# EAGLE design MicroMod-Teensy (EAGLE 9.6.2)
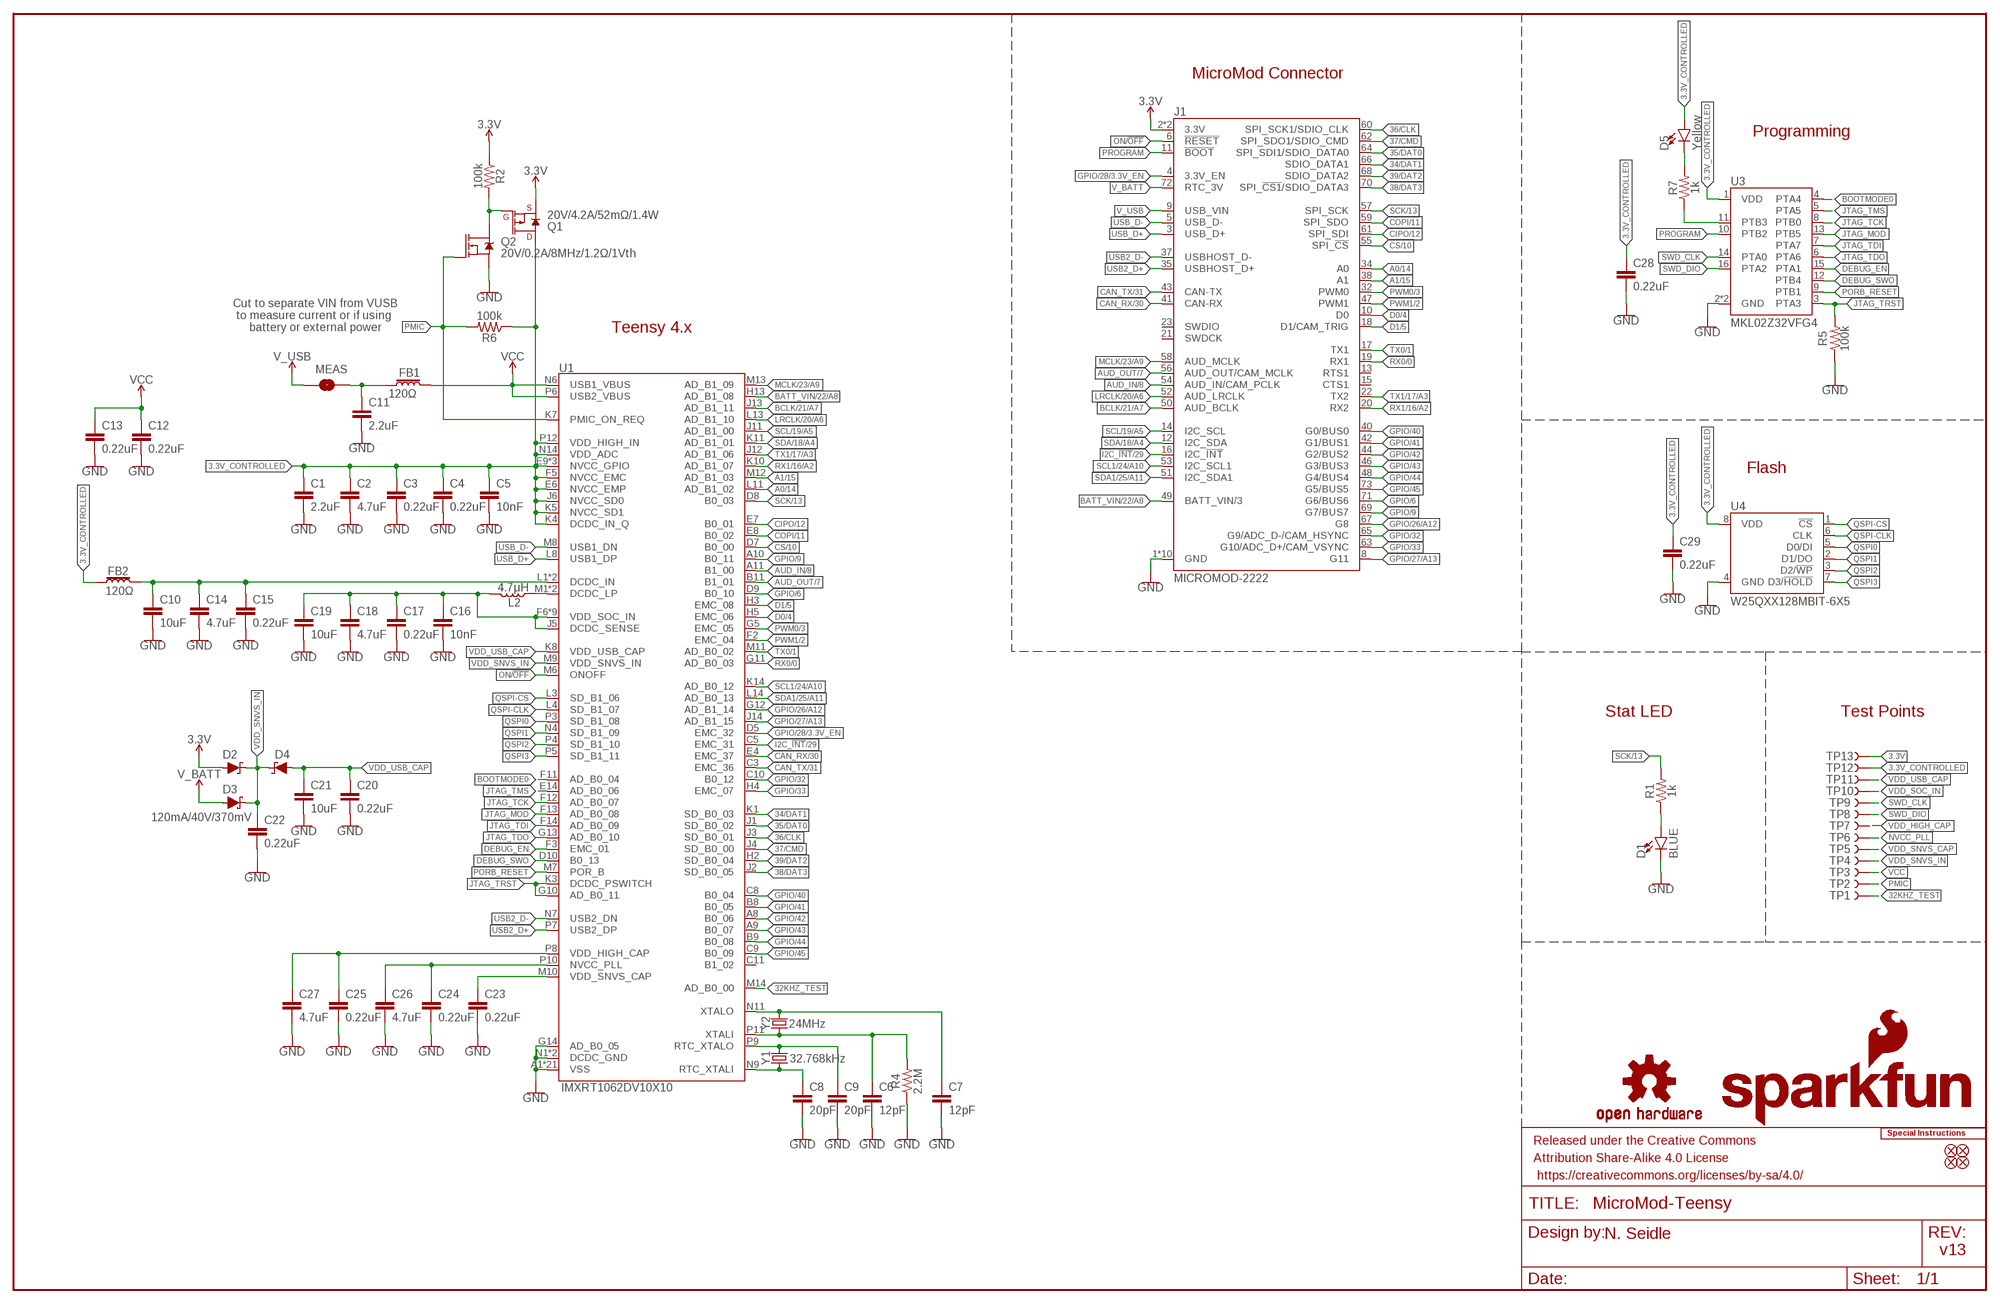
[diagram p0: schematic, sheet 1]

## Parts
C1  2.2uF  2.2UF-0402_TIGHT-10V-10%-X5R  [0402-TIGHT]
C2  4.7uF  4.7UF-0402_TIGHT-6.3V-20%-X5R  [0402-TIGHT]
C3  0.22uF  0.22UF-0402T-10V-10%  [0402-TIGHT]
C4  0.22uF  0.22UF-0402T-10V-10%  [0402-TIGHT]
C5  10nF  10NF-0402T-25V-10%  [0402-TIGHT]
C6  12pF  12PF-0402T-50V-5%  [0402-TIGHT]
C7  12pF  12PF-0402T-50V-5%  [0402-TIGHT]
C8  20pF  20PF-0402T-50V-5%  [0402-TIGHT]
C9  20pF  20PF-0402T-50V-5%  [0402-TIGHT]
C10  10uF  10UF-0402T-6.3V-20%  [0402-TIGHT]
C11  2.2uF  2.2UF-0402_TIGHT-10V-10%-X5R  [0402-TIGHT]
C12  0.22uF  0.22UF-0402T-10V-10%  [0402-TIGHT]
C13  0.22uF  0.22UF-0402T-10V-10%  [0402-TIGHT]
C14  4.7uF  4.7UF-0402_TIGHT-6.3V-20%-X5R  [0402-TIGHT]
C15  0.22uF  0.22UF-0402T-10V-10%  [0402-TIGHT]
C16  10nF  10NF-0402T-25V-10%  [0402-TIGHT]
C17  0.22uF  0.22UF-0402T-10V-10%  [0402-TIGHT]
C18  4.7uF  4.7UF-0402_TIGHT-6.3V-20%-X5R  [0402-TIGHT]
C19  10uF  10UF-0402T-6.3V-20%  [0402-TIGHT]
C20  0.22uF  0.22UF-0402T-10V-10%  [0402-TIGHT]
C21  10uF  10UF-0402T-6.3V-20%  [0402-TIGHT]
C22  0.22uF  0.22UF-0402T-10V-10%  [0402-TIGHT]
C23  0.22uF  0.22UF-0402T-10V-10%  [0402-TIGHT]
C24  0.22uF  0.22UF-0402T-10V-10%  [0402-TIGHT]
C25  0.22uF  0.22UF-0402T-10V-10%  [0402-TIGHT]
C26  4.7uF  4.7UF-0402_TIGHT-6.3V-20%-X5R  [0402-TIGHT]
C27  4.7uF  4.7UF-0402_TIGHT-6.3V-20%-X5R  [0402-TIGHT]
C28  0.22uF  0.22UF-0402T-10V-10%  [0402-TIGHT]
C29  0.22uF  0.22UF-0402T-10V-10%  [0402-TIGHT]
D1  BLUE  LED-BLUE0603  [LED-0603]
D2  120mA/40V/370mV  DIODE-SCHOTTKY-RB751S40  [SOD-523]
D3  120mA/40V/370mV  DIODE-SCHOTTKY-RB751S40  [SOD-523]
D4  120mA/40V/370mV  DIODE-SCHOTTKY-RB751S40  [SOD-523]
D5  Yellow  LED-YELLOW0603  [LED-0603]
FB1  120Ω  FERRITE_BEAD-120_OHM-0402T  [0402-TIGHT]
FB2  120Ω  FERRITE_BEAD-120_OHM-0402T  [0402-TIGHT]
FD1  FIDUCIALUFIDUCIAL  [FIDUCIAL-MICRO]
FD2  FIDUCIALUFIDUCIAL  [FIDUCIAL-MICRO]
FD3  FIDUCIALUFIDUCIAL  [FIDUCIAL-MICRO]
FD4  FIDUCIALUFIDUCIAL  [FIDUCIAL-MICRO]
FRAME1  FRAME-LEDGER  [CREATIVE_COMMONS]
J1  MICROMOD-2222  [M.2-CARD-E-22]
L2  4.7μH  4.7μH_SHIELDED_INDUCTOR  [1008(2520)]
LOGO1  SFE_LOGO_NAME_FLAME.1_INCH  [SFE_LOGO_NAME_FLAME_.1]
LOGO2  OSHW-LOGONO_SILK  [DUMMY]
LOGO3  SPECIAL_INSTRUCTIONS-ORDERING  [ORDERING_INSTRUCTIONS]
MEAS  JUMPER-SMT_2_NC_TRACE_SILK  [SMT-JUMPER_2_NC_TRACE_SILK]
Q1  20V/4.2A/52mΩ/1.4W  MOSFET_PCH-DMG2305UX-7  [SOT23-3]
Q2  20V/0.2A/8MHz/1.2Ω/1Vth  MOSFET-NCH-RE1C00UNTL  [SOT-416FL]
R1  1k  1KOHM-0402T-1/16W-1%  [0402-TIGHT]
R2  100k  100KOHM-0402T-1/16W-1%  [0402-TIGHT]
R4  2.2M  2.2MOHMS-0402T-1/10W-1%  [0402-TIGHT]
R5  100k  100KOHM-0402T-1/16W-1%  [0402-TIGHT]
R6  100k  100KOHM-0402T-1/16W-1%  [0402-TIGHT]
R7  1k  1KOHM-0402T-1/16W-1%  [0402-TIGHT]
TP1  TEST-POINT3  [PAD.03X.03]
TP2  TEST-POINT3  [PAD.03X.03]
TP3  TEST-POINT3  [PAD.03X.03]
TP4  TEST-POINT3  [PAD.03X.03]
TP5  TEST-POINT3  [PAD.03X.03]
TP6  TEST-POINT3  [PAD.03X.03]
TP7  TEST-POINT3  [PAD.03X.03]
TP8  TEST-POINT3  [PAD.03X.03]
TP9  TEST-POINT3  [PAD.03X.03]
TP10  TEST-POINT3  [PAD.03X.03]
TP11  TEST-POINT3  [PAD.03X.03]
TP12  TEST-POINT3  [PAD.03X.03]
TP13  TEST-POINT3  [PAD.03X.03]
U1  IMXRT1062DV10X10  [IMXRT1062]
U3  MKL02Z32VFG4  MKL02Z32VFG4QFN-16  [QFN-16]
U4  W25QXX128MBIT-6X5  W25QXX128MBIT-6X5-SKINNY_CENTER  [WSON-8-6X5-SKINNY_CENTERPAD]
Y1  32.768kHz  CRYSTAL-32.768KHZSMD-3.2X1.5  [CRYSTAL-SMD-3.2X1.5MM]
Y2  24MHz  CRYSTAL-24MHZ-SMD-2.0X1.6MM  [CRYSTAL-SMD-2.0X1.6MM]

## Nets
3.3V: D2.A J1.2(3.3V) J1.74(3.3V) Q1.2(S) R2.1 TP13.P$1
3.3V_CONTROLLED [InternalPower]: C1.1 C2.1 C3.1 C4.1 C5.1 C28.1 C29.1 D5.A FB2.1 Q1.3(D) R6.1 TP12.P$1 U1.E6(NVCC_EMP) U1.E9(NVCC_GPIO) U1.F5(NVCC_EMC) U1.F10(NVCC_GPIO) U1.J6(NVCC_SD0) U1.J10(NVCC_GPIO) U1.K4(DCDC_IN_Q) U1.K5(NVCC_SD1) U1.N14(VDD_ADC) U1.P12(VDD_HIGH_IN) U3.1(VDD) U4.8(VDD)
24MHZ_1: C7.1 U1.N11(XTALO) Y2.3
24MHZ_2: C6.1 R4.2 U1.P11(XTALI) Y2.1
32KHZ_1: C8.1 U1.N9(RTC_XTALI) Y1.P$1
32KHZ_2: C9.1 U1.P9(RTC_XTALO) Y1.P$2
32KHZ_TEST: TP1.P$1 U1.M14(AD_B0_00)
34/DAT1: J1.66(SDIO_DATA1) U1.K1(SD_B0_03)
35/DAT0: J1.64(SPI_SDI1/SDIO_DATA0) U1.J1(SD_B0_02)
36/CLK [Clock]: J1.60(SPI_SCK1/SDIO_CLK) U1.J3(SD_B0_01)
37/CMD: J1.62(SPI_SDO1/SDIO_CMD) U1.J4(SD_B0_00)
38/DAT3: J1.70(SPI_!CS1!/SDIO_DATA3) U1.J2(SD_B0_05)
39/DAT2: J1.68(SDIO_DATA2) U1.H2(SD_B0_04)
A0/14: J1.34(A0) U1.L11(AD_B1_02)
A1/15: J1.38(A1) U1.M12(AD_B1_03)
AUD_IN/8: J1.54(AUD_IN/CAM_PCLK) U1.A11(B1_00)
AUD_OUT/7: J1.56(AUD_OUT/CAM_MCLK) U1.B11(B1_01)
BATT_VIN/22/A8: J1.49(BATT_VIN/3) U1.H13(AD_B1_08)
BCLK/21/A7: J1.50(AUD_BCLK) U1.J13(AD_B1_11)
BOOTMODE0: U1.F11(AD_B0_04) U3.4(PTA4)
CAN_RX/30: J1.41(CAN-RX) U1.E4(EMC_37)
CAN_TX/31: J1.43(CAN-TX) U1.C3(EMC_36)
CIPO/12: J1.61(SPI_SDI) U1.E7(B0_01)
COPI/11: J1.59(SPI_SDO) U1.E8(B0_02)
CS/10: J1.55(SPI_!CS!) U1.D7(B0_00)
D0/4: J1.10(D0) U1.H5(EMC_06)
D1/5: J1.18(D1/CAM_TRIG) U1.H3(EMC_08)
DCDC_IN [InternalPower]: C10.1 C14.1 C15.1 FB2.2 U1.L1(DCDC_IN) U1.L2(DCDC_IN)
DCDC_LP [DCBoost]: L2.1 U1.M1(DCDC_LP) U1.M2(DCDC_LP)
DEBUG_EN: U1.F3(EMC_01) U3.15(PTA1)
DEBUG_SWO: U1.D10(B0_13) U3.12(PTB4)
GND: C1.2 C2.2 C3.2 C4.2 C5.2 C6.2 C7.2 C8.2 C9.2 C10.2 C11.2 C12.2 C13.2 C14.2 C15.2 C16.2 C17.2 C18.2 C19.2 C20.2 C21.2 C22.2 C23.2 C24.2 C25.2 C26.2 C27.2 C28.2 C29.2 D1.C J1.1(GND) J1.7(GND) J1.33(GND) J1.36(GND) J1.39(GND) J1.45(GND) J1.75(GND) J1.GND1(GND) J1.GND2(GND) J1.GND3(GND) Q2.2(S) R4.1 R5.1 U1.A1(VSS) U1.A14(VSS) U1.B5(VSS) U1.B10(VSS) U1.E2(VSS) U1.E13(VSS) U1.G7(VSS) U1.G8(VSS) U1.G14(AD_B0_05) U1.H7(VSS) U1.H8(VSS) U1.J7(VSS) U1.J8(VSS) U1.K2(VSS) U1.K6(VSS) U1.K9(VSS) U1.K13(VSS) U1.L9(VSS) U1.N1(DCDC_GND) U1.N2(DCDC_GND) U1.N5(VSS) U1.N8(VSS) U1.P1(VSS) U1.P14(VSS) U3.2(GND) U3.17(GND) U4.4(GND)
GPIO/6: J1.71(G6/BUS6) U1.D9(B0_10)
GPIO/9: J1.69(G7/BUS7) U1.A10(B0_11)
GPIO/26/A12: J1.67(G8) U1.G12(AD_B1_14)
GPIO/27/A13: J1.8(G11) U1.J14(AD_B1_15)
GPIO/28/3.3V_EN: J1.4(3.3V_EN) U1.D5(EMC_32)
GPIO/32: J1.65(G9/ADC_D-/CAM_HSYNC) U1.C10(B0_12)
GPIO/33: J1.63(G10/ADC_D+/CAM_VSYNC) U1.H4(EMC_07)
GPIO/40: J1.40(G0/BUS0) U1.C8(B0_04)
GPIO/41: J1.42(G1/BUS1) U1.B8(B0_05)
GPIO/42: J1.44(G2/BUS2) U1.A8(B0_06)
GPIO/43: J1.46(G3/BUS3) U1.A9(B0_07)
GPIO/44: J1.48(G4/BUS4) U1.B9(B0_08)
GPIO/45: J1.73(G5/BUS5) U1.C9(B0_09)
I2C_!INT!/29: J1.16(I2C_!INT!) U1.C5(EMC_31)
JTAG_MOD: U1.F13(AD_B0_08) U3.13(PTB5)
JTAG_TCK: U1.F12(AD_B0_07) U3.8(PTB0)
JTAG_TDI: U1.F14(AD_B0_09) U3.7(PTA7)
JTAG_TDO: U1.G13(AD_B0_10) U3.6(PTA6)
JTAG_TMS: U1.E14(AD_B0_06) U3.5(PTA5)
JTAG_TRST: R5.2 U1.G10(AD_B0_11) U1.K3(DCDC_PSWITCH) U3.3(PTA3)
LRCLK/20/A6: J1.52(AUD_LRCLK) U1.L13(AD_B1_10)
MCLK/23/A9: J1.58(AUD_MCLK) U1.M13(AD_B1_09)
N$2: D1.A R1.1
N$7: Q1.1(G) Q2.3(D) R2.2
N$10 [InternalPower]: C11.1 FB1.1 MEAS.2
N$12: R7.1 U3.11(PTB3)
N$13: D5.C R7.2
NVCC_PLL: C24.1 C26.1 TP6.P$1 U1.P10(NVCC_PLL)
ON/!OFF!: J1.6(!RESET!) U1.M6(ONOFF)
PMIC: Q2.1(G) R6.2 TP2.P$1 U1.K7(PMIC_ON_REQ)
PORB_RESET: U1.M7(POR_B) U3.9(PTB1)
PROGRAM: J1.11(!BOOT!) U3.10(PTB2)
PWM0/3: J1.32(PWM0) U1.G5(EMC_05)
PWM1/2: J1.47(PWM1) U1.F2(EMC_04)
QSPI0: U1.P3(SD_B1_08) U4.5(D0/DI)
QSPI1: U1.N4(SD_B1_09) U4.2(D1/DO)
QSPI2: U1.P4(SD_B1_10) U4.3(D2/!WP!)
QSPI3: U1.P5(SD_B1_11) U4.7(D3/!HOLD!)
QSPI-CLK [Clock]: U1.L4(SD_B1_07) U4.6(CLK)
QSPI-CS: U1.L3(SD_B1_06) U4.1(!CS!)
RX0/0: J1.19(RX1) U1.G11(AD_B0_03)
RX1/16/A2: J1.20(RX2) U1.K10(AD_B1_07)
SCK/13 [Clock]: J1.57(SPI_SCK) R1.2 U1.D8(B0_03)
SCL1/24/A10: J1.53(I2C_SCL1) U1.K14(AD_B0_12)
SCL/19/A5: J1.14(I2C_SCL) U1.J11(AD_B1_00)
SDA1/25/A11: J1.51(I2C_SDA1) U1.L14(AD_B0_13)
SDA/18/A4: J1.12(I2C_SDA) U1.K11(AD_B1_01)
SWD_CLK: TP9.P$1 U3.14(PTA0)
SWD_DIO: TP8.P$1 U3.16(PTA2)
TX0/1: J1.17(TX1) U1.M11(AD_B0_02)
TX1/17/A3: J1.22(TX2) U1.J12(AD_B1_06)
USB2_D+ [90Ohm]: J1.35(USBHOST_D+) U1.P7(USB2_DP)
USB2_D- [90Ohm]: J1.37(USBHOST_D-) U1.N7(USB2_DN)
USB_D+ [90Ohm]: J1.3(USB_D+) U1.L8(USB1_DP)
USB_D- [90Ohm]: J1.5(USB_D-) U1.M8(USB1_DN)
V_BATT: D3.A J1.72(RTC_3V)
V_USB [InternalPower]: J1.9(USB_VIN) MEAS.1
VCC [InternalPower]: C12.1 C13.1 FB1.2 TP3.P$1 U1.N6(USB1_VBUS) U1.P6(USB2_VBUS)
VDD_HIGH_CAP: C25.1 C27.1 TP7.P$1 U1.P8(VDD_HIGH_CAP)
VDD_SNVS_CAP: C23.1 TP5.P$1 U1.M10(VDD_SNVS_CAP)
VDD_SNVS_IN: C22.1 D2.C D3.C D4.C TP4.P$1 U1.M9(VDD_SNVS_IN)
VDD_SOC_IN [InternalPower]: C16.1 C17.1 C18.1 C19.1 L2.2 TP10.P$1 U1.F6(VDD_SOC_IN) U1.F7(VDD_SOC_IN) U1.F8(VDD_SOC_IN) U1.F9(VDD_SOC_IN) U1.G6(VDD_SOC_IN) U1.G9(VDD_SOC_IN) U1.H6(VDD_SOC_IN) U1.H9(VDD_SOC_IN) U1.J5(DCDC_SENSE) U1.J9(VDD_SOC_IN)
VDD_USB_CAP: C20.1 C21.1 D4.A TP11.P$1 U1.K8(VDD_USB_CAP)
Unconnected: J1.13(RTS1) J1.15(CTS1) J1.21(SWDCK) J1.23(SWDIO) U1.C11(B1_02)

## Notes on the sheet
- MicroMod Connector
- Programming
- Cut to separate VIN from VUSB
  to measure current or if using 
  battery or external power
- Teensy 4.x
- Flash
- Stat LED | Test Points
- N. Seidle
- v13

## Library data of the parts
C1 C11 = SparkFun-Capacitors:2.2UF: 2.2µF ceramic capacitors A capacitor is a passive two-terminal electrical component used to store electrical energy temporarily in an electric field.; PROD_ID: CAP-14232
C2 C14 C18 C26 C27 = SparkFun-Capacitors:4.7UF: 4.7µF ceramic capacitors A capacitor is a passive two-terminal electrical component used to store electrical energy temporarily in an electric field.; PROD_ID: CAP-14240
C3 C4 C12 C13 C15 C17 C20 C22-C25 C28 C29 = SparkFun-Capacitors:0.22UF: 0.22µF ceramic capacitors A capacitor is a passive two-terminal electrical component used to store electrical energy temporarily in an electric field.; PROD_ID: CAP-14846
C5 C16 = SparkFun-Capacitors:10NF: 0.01uF/10nF/10,000pF ceramic capacitors A capacitor is a passive two-terminal electrical component used to store electrical energy temporarily in an electric field. CAP-09321; PROD_ID: CAP-14847
C6 C7 = SparkFun-Capacitors:12PF: 12pF ceramic capacitors A capacitor is a passive two-terminal electrical component used to store electrical energy temporarily in an electric field.; PROD_ID: CAP-14665
C8 C9 = SparkFun-Capacitors:20PF: 20pF ceramic capacitors A capacitor is a passive two-terminal electrical component used to store electrical energy temporarily in an electric field.; PROD_ID: CAP-14843
C10 C19 C21 = SparkFun-Capacitors:10UF: 10.0µF ceramic capacitors A capacitor is a passive two-terminal electrical component used to store electrical energy temporarily in an electric field.; PROD_ID: CAP-14848
D1 = SparkFun-LED:LED-BLUE: Blue SMD LED Used in manufacturing of various products at SparkFun Packages: 0603 - SMD 0603 package [Product Link] <http://www.digikey.com/product-detail/en/SMLE12BC7TT86/511-1589-2-ND/1641808> 1206 - SMD1206 package [Product Link] <http://www.digikey.com/product-detail/en/lite-on-inc/LTST-C150TBKT/160-1643-1-ND/573584> SparkFun Products: ESP8266 Thing-Dev Board <https://www.sparkfun.com/products/13711> RedBoard <https://www.sparkfun.com/products/12757>; PROD_ID: DIO-08575
D2-D4 = SparkFun-DiscreteSemi:DIODE-SCHOTTKY: Schottky diode A Schottky diode is a semiconductor diode which has a low forward voltage drop and a very fast switching action.; PROD_ID: DIO-11018
D5 = SparkFun-LED:LED-YELLOW: Yellow SMD LED Used in manufacturing several products at SparkFun. Packages: 0603 - SMD 0603 package[Product Link] <http://www.kingbrightusa.com/product.asp?catalog_name=LED&product_id=APT1608SYCK> 0603 -SMART - SMART SMD 0603 package (more efficient/more expensive) [Product Link] <http://www.osram-os.com/osram_os/en/products/product-catalog/led-light-emitting-diodes/smartled-0603/ly-l29k/index.jsp> LilyPad - SMD1206 package[Product Datasheet] <https://www.sparkfun.com/datasheets/DevTools/LilyPad/Q150YUS4.pdf> SparkFun Products: Blynk Board <https://www.sparkfun.com/products/13794> IOIO-OTG <https://www.sparkfun.com/products/13613> XBee Explorer Serial <https://www.sparkfun.com/products/13225>; PROD_ID: DIO-09003
FB1 FB2 = SparkFun-Coils:FERRITE_BEAD-120_OHM: Ferrite Bead (blocks, cores, rings, chokes, etc.) Inductor with layers of ferrite used to suppress high frequencies. Often used to isolate high frequency noise.; PROD_ID: NDUC-14206
FD1-FD4 = SparkFun-Aesthetics:FIDUCIAL: Fiducial Alignment Points Point-of-reference for pick-and-place machines and other optical instruments.
FRAME1 = SparkFun-Aesthetics:FRAME-LEDGER: Schematic Frame - Ledger Standard 11x14 US Ledger frame
J1 = SparkFun-MicroMod:MICROMOD: MicroMod Connector Description: A card edge connector and mating PCB connector to allow various MicroMod Processor Boards to be coupled with various carrier boards of different capabilities. Based on the M.2 standard.
L2 = SparkFun-Coils:4.7μH_SHIELDED_INDUCTOR: 4.7uH Inductor 4.7uH 1.4A 50mOhm 1008(2520) Package Shielded; PROD_ID: NDUC-14880
LOGO1 = SparkFun-Aesthetics:SFE_LOGO_NAME_FLAME: SparkFun Font Logo w/ Flame This is the SparkFun full logo. The logo on the schematic will always be the same size; the package variant is the height of the flame part of the logo. Default layer for the logo on the board is tSilk.
LOGO2 = SparkFun-Aesthetics:OSHW-LOGO: Open-Source Hardware (OSHW) Logo This logo indicates the piece of hardware it is found on incorporates a OSHW license and/or adheres to the definition of open source hardware found here: http://freedomdefined.org/OSHW
LOGO3 = SparkFun-Aesthetics:SPECIAL_INSTRUCTIONS: Special Ordering/Production Instructions Alert Symbol for special PCB ordering instructions or unique production process warnings. Ordering Instructions Production Instructions Types of information that should be added to box: Copper weight Soldermask color Silk color PCB thickness Number of layers PCB Standard: 1.6mm FR4 1 oz copper immersion silver plating red soldermask white silkscreen Types of information that should be added to box: Special wash requirements Depaneling instructions Humidification Glue curing Default text settings: 0.07 inch 9% ratio 50% line distance
MEAS = SparkFun-Jumpers:JUMPER-SMT_2_NC_TRACE: Normally closed trace jumper This jumper has a trace between two pads so it's normally closed (NC). Use a razor knife to open the connection. For best results follow the IPC guidelines for cutting traces: Cutout at least 0.063 mm (0.005 in). Remove all loose material to clean up the cut area. Seal the cut with an approved epoxy. Reapply solder to reclose the connection.
Q1 = SparkFun-DiscreteSemi:MOSFET_PCH: P-channel MOSFETs Voltage controlled devices that allow control of high current outputs. SparkFun Products: SparkFun ESP32 Thing <https://www.sparkfun.com/products/13907> SparkFun ESP8266 Thing <https://www.sparkfun.com/products/13231> SparkFun Pi Servo HAT V2 <https://www.sparkfun.com/products/15316> DMG2305UX-7 (20V/4.2A/SOT23-3); PROD_ID: TRAN-14388
Q2 = SparkFun-DiscreteSemi:MOSFET-NCH: N-channel MOSFETs Voltage controlled devices that allow control of high current outputs. SparkFun Products: SparkFun OpenScale <https://www.sparkfun.com/products/13261> SparkFun Digital Sandbox <https://www.sparkfun.com/products/12651> SparkFun Monster Moto Shield <https://www.sparkfun.com/products/10182> SparkFun MOSFET Power Controller <https://www.sparkfun.com/products/11214>; PROD_ID: TRANS-14399
R1 R7 = SparkFun-Resistors:1KOHM: 1kΩ resistor A resistor is a passive two-terminal electrical component that implements electrical resistance as a circuit element. Resistors act to reduce current flow, and, at the same time, act to lower voltage levels within circuits. - Wikipedia; PROD_ID: RES-14342
R2 R5 R6 = SparkFun-Resistors:100KOHM: 100kΩ resistor A resistor is a passive two-terminal electrical component that implements electrical resistance as a circuit element. Resistors act to reduce current flow, and, at the same time, act to lower voltage levels within circuits. - Wikipedia; PROD_ID: RES-13495
R4 = SparkFun-Resistors:2.2MOHMS: 2MΩ resistor A resistor is a passive two-terminal electrical component that implements electrical resistance as a circuit element. Resistors act to reduce current flow, and, at the same time, act to lower voltage levels within circuits. - Wikipedia; PROD_ID: RES-14844
TP1-TP13 = SparkFun-Connectors:TEST-POINT: SparkFun Test Points Bare copper test points for troubleshooting or In-Circuit-Testing. These are used by our Production team for verifying production board runs using pogo-pins on test beds. SparkFun Products: SparkFun LSM9DS1 Breakout <https://www.sparkfun.com/products/13284> SparkFun PSOC <https://www.sparkfun.com/products/13714> SparkFun Load Cell Amplifier <https://www.sparkfun.com/products/13879>
U1 = Teensy:IMXRT1062DV; PROD_ID: IC-14904
U3 = Teensy:MKL02Z32VFG4; PROD_ID: IC-14906
U4 = SparkFun-MicroMod:W25QXX; PROD_ID: IC-15107
Y1 = SparkFun-Clocks:CRYSTAL-32.768KHZ: 32.768kHz Crystal Frequency: 32.768kHz Frequency Stability: ±20ppm Load Capacitance: 12.5pF (PTH-2X6 & SMD-3.2X1.5), 6pF (SMD-2X6) SparkFun Products: SparkFun BigTime Watch Kit <https://www.sparkfun.com/products/11734> SparkFun nRF52832 Breakout <https://www.sparkfun.com/products/13990> SparkFun Real Time Clock Module <https://www.sparkfun.com/products/12708>; PROD_ID: XTAL-13062
Y2 = SparkFun-Clocks:CRYSTAL-24MHZ: 24MHz Crystal Datasheet <http://www.sparkfun.com/datasheets/Components/AT-SMD-5x3.pdf> Frequency: 24MHz Frequency Tolerance: ±20ppm Load Capacitance: 12pF SparkFun Products: USB Bit Whacker <https://www.sparkfun.com/products/762>; PROD_ID: XTAL-14845

## Net classes
1 90Ohm: width 0.114 mm, clearance 0.127 mm
2 Clock: width 0.089 mm, clearance 0.178 mm
3 DCBoost: width 0.381 mm
4 InternalPower: width 0.152 mm

## Board
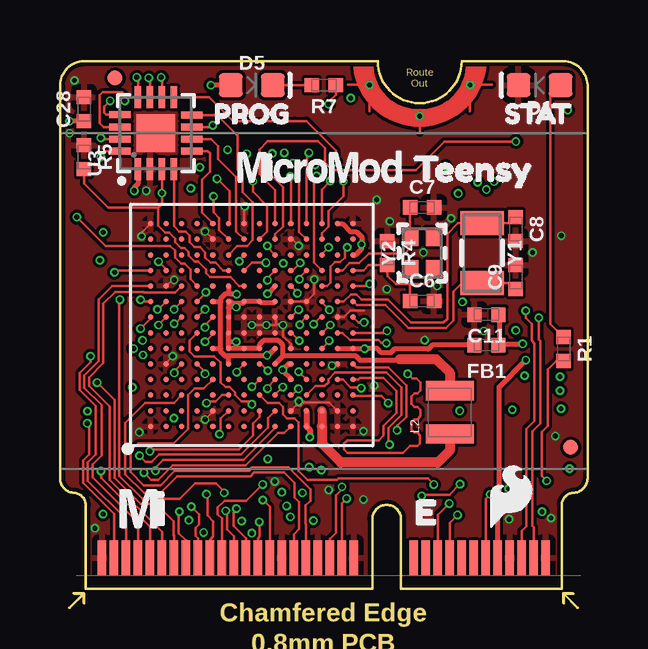
[diagram p1: board, top side]
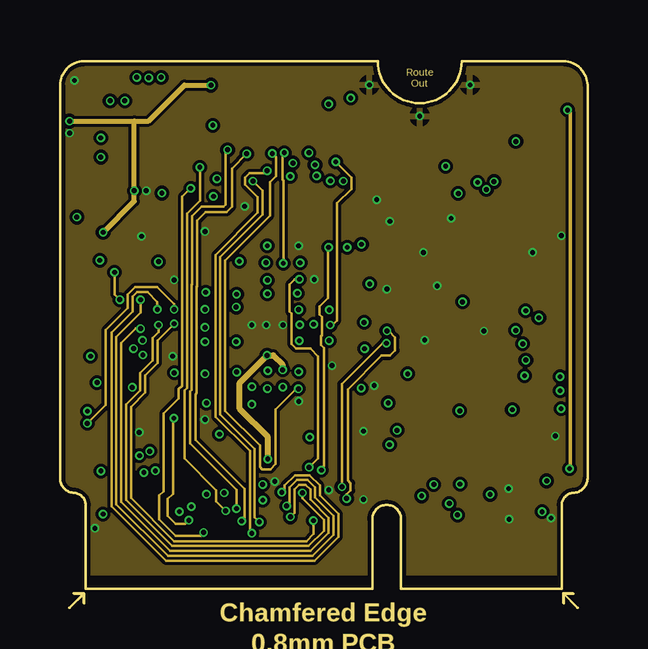
[diagram p2: board, inner layer Vert-GND]
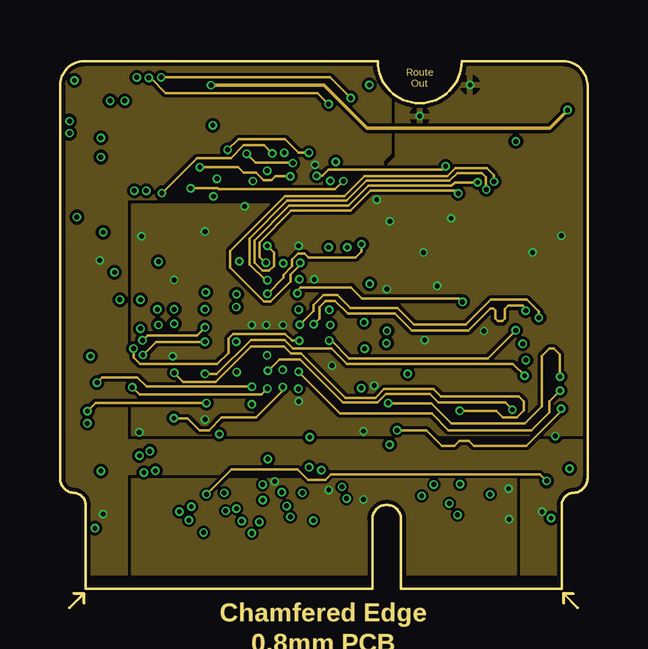
[diagram p3: board, inner layer Horz-3V3]
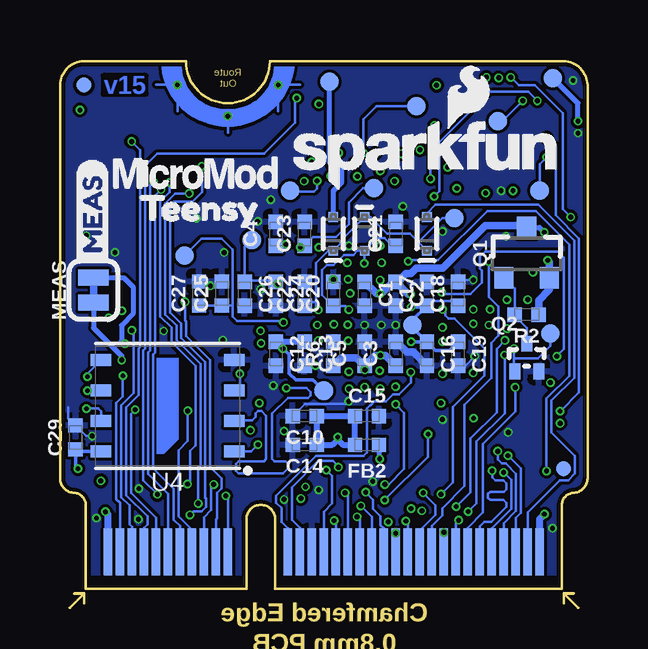
[diagram p4: board, bottom side, seen from below]

Size 22 x 22 mm. Coordinates in mm from the lower left corner, seen from the top.
Outline: 16.75,22 21,22 arc-87 22,21 22,4.6 arc-87 21.4,4 arc85 20.93,3.5 20.93,0 14.22,0 14.22,2.9 arc180 13.03,2.9 13.03,0 1.07,0 1.07,3.5 arc84 0.6,4 arc-87 0,4.6 0,21 arc-87 1,22 13.25,22
Outline: 16.75,22 arc-180 13.25,22
Outline: 16.75,22 arc-180 13.25,22
Copper layers (1+2*15+16): Top 0.035mm / dielectric 1.5mm / Vert-GND 0.035mm / dielectric 0.15mm / Horz-3V3 0.035mm / dielectric 0.2mm / Bottom 0.035mm
Design rules "SparkFun-4-layer-MicroMod": minimum track width 4mil, minimum drill 0.2mm, track to track 4mil, track to pad 4mil, pad to pad 4mil, via to via 4mil, smd to smd 4mil, copper to edge 6mil, drill to drill 6mil, minimum pad ring 3mil, minimum via ring 3mil, stop-mask expansion 4mil, vias tented up to drill 25mil, thermal gap 10mil
Milling: 6 lines

### Footprints (pad centres in the part's own frame; a part is rotated, then mirrored left to right if it is on the bottom)
0402-TIGHT = smd 0.6 x 0.6: 1 -0.5,0; 2 0.5,0
LED-0603 = smd 1 x 1: A -0.877,0; C 0.877,0
SOD-523 = smd 0.4 x 0.4: A -0.7,0; C 0.7,0
FIDUCIAL-MICRO = smd 0.635 x 0.635: 1 0,0
M.2-CARD-E-22 = smd 0.35 x 1.45: 1 9.25,1.275; 3 8.75,1.275; 5 8.25,1.275; 7 7.75,1.275; 9 7.25,1.275; 11 6.75,1.275; 13 6.25,1.275; 15 5.75,1.275; 17 5.25,1.275; 19 4.75,1.275; 21 4.25,1.275; 23 3.75,1.275; 33 1.25,1.275; 35 0.75,1.275; 37 0.25,1.275; 39 -0.25,1.275; 41 -0.75,1.275; 43 -1.25,1.275; 45 -1.75,1.275; 47 -2.25,1.275; 49 -2.75,1.275; 51 -3.25,1.275; 53 -3.75,1.275; 55 -4.25,1.275; 57 -4.75,1.275; 59 -5.25,1.275; 61 -5.75,1.275; 63 -6.25,1.275; 65 -6.75,1.275; 67 -7.25,1.275; 69 -7.75,1.275; 71 -8.25,1.275; 73 -8.75,1.275; 75 -9.25,1.275 | smd 0.35 x 1.95 bottom: 2 9,1.525; 4 8.5,1.525; 6 8,1.525; 8 7.5,1.525; 10 7,1.525; 12 6.5,1.525; 14 6,1.525; 16 5.5,1.525; 18 5,1.525; 20 4.5,1.525; 22 4,1.525; 32 1.5,1.525; 34 1,1.525; 36 0.5,1.525; 38 0,1.525; 40 -0.5,1.525; 42 -1,1.525; 44 -1.5,1.525; 46 -2,1.525; 48 -2.5,1.525; 50 -3,1.525; 52 -3.5,1.525; 54 -4,1.525; 56 -4.5,1.525; 58 -5,1.525; 60 -5.5,1.525; 62 -6,1.525; 64 -6.5,1.525; 66 -7,1.525; 68 -7.5,1.525; 70 -8,1.525; 72 -8.5,1.525; 74 -9,1.525 | drill 0.2: GND1 1.9,21; GND2 4,19.7; GND3 6.1,21
1008(2520) = smd 0.8 x 2: 1 -0.9,0; 2 0.9,0
SMT-JUMPER_2_NC_TRACE_SILK = smd 0.66 x 1.27: 1 -0.521,0; 2 0.521,0
SOT23-3 = smd 0.8 x 0.9: 1 -0.95,-1; 2 0.95,-1; 3 0,1.1
SOT-416FL = smd 0.46 x 0.65: 1 -0.5,-1.1; 2 0.5,-1.1; 3 0,0.05
PAD.03X.03 = smd 0.762 x 0.762: P$1 0,0
IMXRT1062 = smd 0.234 x 0.234: A1 -4.225,4.225; A2 -3.575,4.225; A3 -2.925,4.225; A4 -2.275,4.225; A5 -1.625,4.225; A6 -0.975,4.225; A7 -0.325,4.225; A8 0.325,4.225; A9 0.975,4.225; A10 1.625,4.225; A11 2.275,4.225; A12 2.925,4.225; A13 3.575,4.225; A14 4.225,4.225; B1 -4.225,3.575; B2 -3.575,3.575; B3 -2.925,3.575; B4 -2.275,3.575; B5 -1.625,3.575; B6 -0.975,3.575; B7 -0.325,3.575; B8 0.325,3.575; B9 0.975,3.575; B10 1.625,3.575; B11 2.275,3.575; B12 2.925,3.575; B13 3.575,3.575; B14 4.225,3.575; C1 -4.225,2.925; C2 -3.575,2.925; C3 -2.925,2.925; C4 -2.275,2.925; C5 -1.625,2.925; C6 -0.975,2.925; C7 -0.325,2.925; C8 0.325,2.925; C9 0.975,2.925; C10 1.625,2.925; C11 2.275,2.925; C12 2.925,2.925; C13 3.575,2.925; C14 4.225,2.925; D1 -4.225,2.275; D2 -3.575,2.275; D3 -2.925,2.275; D4 -2.275,2.275; D5 -1.625,2.275; D6 -0.975,2.275; D7 -0.325,2.275; D8 0.325,2.275; D9 0.975,2.275; D10 1.625,2.275; D11 2.275,2.275; D12 2.925,2.275; D13 3.575,2.275; D14 4.225,2.275; E1 -4.225,1.625; E2 -3.575,1.625; E3 -2.925,1.625; E4 -2.275,1.625; E5 -1.625,1.625; E6 -0.975,1.625; E7 -0.325,1.625; E8 0.325,1.625; E9 0.975,1.625; E10 1.625,1.625; E11 2.275,1.625; E12 2.925,1.625; E13 3.575,1.625; E14 4.225,1.625; F1 -4.225,0.975; F2 -3.575,0.975; F3 -2.925,0.975; F4 -2.275,0.975; F5 -1.625,0.975; F6 -0.975,0.975; F7 -0.325,0.975; F8 0.325,0.975; F9 0.975,0.975; F10 1.625,0.975; F11 2.275,0.975; F12 2.925,0.975; F13 3.575,0.975; F14 4.225,0.975; G1 -4.225,0.325; G2 -3.575,0.325; G3 -2.925,0.325; G4 -2.275,0.325; G5 -1.625,0.325; G6 -0.975,0.325; G7 -0.325,0.325; G8 0.325,0.325; G9 0.975,0.325; G10 1.625,0.325; G11 2.275,0.325; G12 2.925,0.325; G13 3.575,0.325; G14 4.225,0.325; H1 -4.225,-0.325; H2 -3.575,-0.325; H3 -2.925,-0.325; H4 -2.275,-0.325; H5 -1.625,-0.325; H6 -0.975,-0.325; H7 -0.325,-0.325; H8 0.325,-0.325; H9 0.975,-0.325; H10 1.625,-0.325; H11 2.275,-0.325; H12 2.925,-0.325; H13 3.575,-0.325; H14 4.225,-0.325; J1 -4.225,-0.975; J2 -3.575,-0.975; J3 -2.925,-0.975; J4 -2.275,-0.975; J5 -1.625,-0.975; J6 -0.975,-0.975; J7 -0.325,-0.975; J8 0.325,-0.975; J9 0.975,-0.975; J10 1.625,-0.975; J11 2.275,-0.975; J12 2.925,-0.975; J13 3.575,-0.975; J14 4.225,-0.975; K1 -4.225,-1.625; K2 -3.575,-1.625; K3 -2.925,-1.625; K4 -2.275,-1.625; K5 -1.625,-1.625; K6 -0.975,-1.625; K7 -0.325,-1.625; K8 0.325,-1.625; K9 0.975,-1.625; K10 1.625,-1.625; K11 2.275,-1.625; K12 2.925,-1.625; K13 3.575,-1.625; K14 4.225,-1.625; L1 -4.225,-2.275; L2 -3.575,-2.275; L3 -2.925,-2.275; L4 -2.275,-2.275; L5 -1.625,-2.275; L6 -0.975,-2.275; L7 -0.325,-2.275; L8 0.325,-2.275; L9 0.975,-2.275; L10 1.625,-2.275; L11 2.275,-2.275; L12 2.925,-2.275; L13 3.575,-2.275; L14 4.225,-2.275; M1 -4.225,-2.925; M2 -3.575,-2.925; M3 -2.925,-2.925; M4 -2.275,-2.925; M5 -1.625,-2.925; M6 -0.975,-2.925; M7 -0.325,-2.925; M8 0.325,-2.925; M9 0.975,-2.925; M10 1.625,-2.925; M11 2.275,-2.925; M12 2.925,-2.925; M13 3.575,-2.925; M14 4.225,-2.925; N1 -4.225,-3.575; N2 -3.575,-3.575; N3 -2.925,-3.575; N4 -2.275,-3.575; N5 -1.625,-3.575; N6 -0.975,-3.575; N7 -0.325,-3.575; N8 0.325,-3.575; N9 0.975,-3.575; N10 1.625,-3.575; N11 2.275,-3.575; N12 2.925,-3.575; N13 3.575,-3.575; N14 4.225,-3.575; P1 -4.225,-4.225; P2 -3.575,-4.225; P3 -2.925,-4.225; P4 -2.275,-4.225; P5 -1.625,-4.225; P6 -0.975,-4.225; P7 -0.325,-4.225; P8 0.325,-4.225; P9 0.975,-4.225; P10 1.625,-4.225; P11 2.275,-4.225; P12 2.925,-4.225; P13 3.575,-4.225; P14 4.225,-4.225
QFN-16 = smd 0.9 x 0.29: 1 -1.5,0.75; 2 -1.5,0.25; 3 -1.5,-0.25; 4 -1.5,-0.75; 9 1.5,-0.75; 10 1.5,-0.25; 11 1.5,0.25; 12 1.5,0.75 | smd 0.29 x 0.9: 5 -0.75,-1.5; 6 -0.25,-1.5; 7 0.25,-1.5; 8 0.75,-1.5; 13 0.765,1.5; 14 0.25,1.5; 15 -0.25,1.5; 16 -0.75,1.5 | smd 1.6 x 1.6: 17 0,0
WSON-8-6X5-SKINNY_CENTERPAD = smd 0.85 x 0.5: 1 -2.775,1.905; 2 -2.775,0.635; 3 -2.775,-0.635; 4 -2.775,-1.905; 5 2.775,-1.905; 6 2.775,-0.635; 7 2.775,0.635; 8 2.775,1.905
CRYSTAL-SMD-3.2X1.5MM = smd 1 x 1.8: P$1 -1.25,0; P$2 1.25,0
CRYSTAL-SMD-2.0X1.6MM = smd 0.75 x 0.7: 1 -0.675,-0.5; 2 0.675,-0.5; 3 0.675,0.5; 4 -0.675,0.5

### Placement (x,y rotation side)
C1  9.3,12.3 270 bottom
C2  8,12.3 270 bottom
C3  8,9.8 90 bottom
C4  13,14.8 90 bottom
C5  9.3,9.8 90 bottom
C6  15.1,12 0 top
C7  15.1,15.9 0 top
C8  19,15 270 top
C9  19,13 90 top
C10  11.8,7.2 180 bottom
C11  17.78,11.43 180 top
C12  13,9.8 270 bottom
C13  11.8,9.8 270 bottom
C14  11.8,6 180 bottom
C15  9.2,7.2 0 bottom
C16  6.7,9.8 270 bottom
C17  6.7,12.3 90 bottom
C18  5.4,12.3 90 bottom
C19  5.4,9.8 270 bottom
C20  10.6,12.3 90 bottom
C21  8,14.8 90 bottom
C22  11.8,12.3 90 bottom
C23  11.8,14.8 90 bottom
C24  13,12.3 270 bottom
C25  15.25,12.31 90 bottom
C26  14.3,12.3 270 bottom
C27  16.2,12.31 90 bottom
C28  1,20 90 top
C29  21.35,6.31 90 bottom
D1  20,21 180 top
D2  10.6,14.8 270 bottom
D3  6.7,14.8 270 bottom
D4  9.3,14.8 90 bottom
D5  8,21 0 top
FB1  17.78,10.16 180 top
FB2  9.2,6 180 bottom
FD1  21.3,5.9 0 top
FD2  2.3,21.3 0 top
FD3  1,5 0 bottom
FD4  21,21 0 bottom
FRAME1  8.85,-21.58 0 top  (outside the outline)
J1  11,0.01 0 top
L2  16.25,7.36 90 top
LOGO1  6.7,18.1 0 bottom
LOGO2  12.25,-21.58 0 top  (outside the outline)
LOGO3  27.49,50.81 0 top  (outside the outline)
MEAS  20.6,12.45 90 bottom
Q1  2.54,13.97 0 bottom
Q2  2.54,10.16 0 bottom
R1  21,10 270 top
R2  2.54,11.43 180 bottom
R4  13.65,14 270 top
R5  1,18 270 top
R6  10.6,9.8 90 bottom
R7  11,21 180 top
TP1  12.4,16.61 270 bottom
TP2  1.55,10.65 0 bottom
TP3  11,8.26 90 bottom
TP4  5.56,15.45 0 bottom
TP5  8.9,16.7 0 bottom
TP6  14,14.55 0 bottom
TP7  16.8,13.9 0 bottom
TP8  2,16.6 0 bottom
TP9  3.74,19.5 0 bottom
TP10  7.3,11 270 bottom
TP11  7.14,20.13 270 bottom
TP12  1.44,21.29 0 bottom
TP13  10.76,21.15 0 bottom
U1  8,11 90 top
U3  4,19 90 top
U4  17.51,7.63 180 bottom
U$1  [TEENSY2]  19.56,15.88 0 bottom
U$3  [TEENSY2]  13.86,17.53 0 top
U$4  [MICROMOD_MI_LOGO_.35]  3.4,3.36 0 top
U$6  [SFE_LOGO_FLAME_.1]  18.8,3.86 0 top
U$7  [MICROMOD_LOGO_.3]  10.79,17.54 0 top
U$8  [MEAS2]  20.65,13.26 90 bottom
U$9  [PROG0]  5.7,19.81 0 top
U$10  [STAT1]  17.8,19.81 0 top
U$11  [MICROMOD_LOGO_.3]  16.38,17.28 0 bottom
Y1  17.6,14 270 top
Y2  15.1,14 90 top

### Tracks (layer width: path | path; a pad name or v marks a point on that pad's centre or on a via)
3.3V  (via drill 0.2)
  Bottom 0.203: D2.A 10.6,16.6 10.24,16.96 10.24,17.41 10.51,17.67 v10.63,17.67 10.66,17.67 10.76,17.77 TP13.P$1
  Bottom 0.3: J1.2 20,3.11 v20.1,3.21 | J1.74 2,2.91 v1.8,3.11
  Bottom 0.305: R2.1 2.04,12.02 1.59,12.47 Q1.2 1.59,13.63 v1.66,13.7
  pour Horz-3V3 (isolate 0.127, rank 3): 0,0.6 0,22 22,22 22,0.6
3.3V_CONTROLLED  (via drill 0.2)
  Top 0.203: U1.K4 9.62,8.74 9.29,9.08 v9.29,9.13 9.53,9.38 U1.K5 | U1.P12 12.33,13.92 12.57,14.16 v12.57,14.37 12.59,14.39 12.59,14.66 12.36,14.89 12.1,14.89 11.77,15.22 U1.N14 | C28.1 v0.4,19.5 | U3.1 3.25,16.89 3.1,16.74 v3.1,16.6 | D5.A v6.3,21 | 7,12.29 7.16,12.29 7.17,12.29 v7.37,12.29 | U1.F10 7.03,12.32 7,12.29 | 7,12.29 6.89,12.29 6.71,12.11 6.71,11.96 | 6.71,10 6.71,11.96 | 6.71,11.96 6.69,11.97 U1.E9 | U1.E6 6.68,10.03 6.71,10 | 6.71,10 6.71,9.89 6.89,9.71 7.05,9.71 | U1.F5 7.03,9.68 7.05,9.71 | U1.J6 8.68,9.73 v8.63,9.73 8.61,9.71 7.05,9.71 | U1.J10 v8.65,12.3
  Vert-GND 0.152: v21.17,19.96 21.29,19.85 21.29,5.04 v21.25,5.01 | v9.29,9.13 9.27,9.13
  Vert-GND 0.203: v1.8,14.86 3.1,16.16 v3.1,16.6 3.1,19.5 | v6.3,21 5.19,21 3.69,19.5 3.1,19.5 | v0.4,19.5 3.1,19.5
  Vert-GND 0.254: v8.67,5.41 8.67,6.33 7.49,7.5 7.49,8.59 v8.63,9.73 8.89,9.73 9.27,9.35 9.27,9.13
  Horz-3V3 0.102: v12.57,14.37 12.57,14.06 12.32,13.81 10.36,13.81 10.2,13.97 9.93,13.97 9.69,13.73 9.69,13.45 9.32,13.08 9.32,12.97 v8.65,12.3
  Horz-3V3 0.152: v6.3,21 11.01,21 11.05,20.96 12.8,19.21 20.42,19.21 v21.17,19.96
  Bottom 0.152: U4.8 21.27,5.72 C29.1 21.35,5.11 v21.25,5.01
  Bottom 0.203: 8.11,12.8 C2.1 7.96,12.75 | v8.65,12.3 | v9.29,9.13 9.3,9.14 | C4.1 12.64,14.3 v12.57,14.37 | 2.63,15.16 Q1.3 2.01,15.07 v1.8,14.86 | v0.4,19.5 0.4,20.25 TP12.P$1 | FB2.1 8.7,5.44 v8.67,5.41
  Bottom 0.305: C5.1 8.87,9.73 v8.63,9.73 8.43,9.73 C3.1 | C1.1 8.8,12.3 v8.65,12.3 8.6,12.3 8.11,12.8 | C5.1 9.3,9.14 | R6.1 10.27,9.63 9.63,9.63 C5.1 | v7.37,12.29 7.49,12.29 7.96,12.75 7.56,13.15 7.36,13.15 7.13,13.38 6.03,13.38 4.25,15.16 2.63,15.16
24MHZ_1
  Top 0.102: U1.N11 11.78,13.28 12.07,13.57 12.48,13.57 12.89,13.98 14.38,13.98 14.6,14.2 Y2.3 C7.1
24MHZ_2
  Top 0.102: Y2.1 15.55,13.28 15.55,12.95 15.3,12.7 14.6,12.7 | U1.P11 12.65,13.28 12.87,13.5 R4.2 13.65,13.05 14,12.7 14.6,12.7 | C6.1 14.6,12.7
32KHZ_1
  Top 0.102: C8.1 18.75,15.25 Y1.P$1 16.6,15.25 16.15,14.8 16.15,11.25 15.99,11.09 14.64,11.09 13.68,12.06 12.58,12.06 12.37,12.28 12.13,12.28 11.83,11.97 U1.N9
32KHZ_2
  Top 0.102: C9.1 18.75,12.75 Y1.P$2 16.75,12.75 16.4,12.4 16.4,11.19 16.08,10.87 14.53,10.87 13.57,11.83 12.38,11.83 12.24,11.97 U1.P9
32KHZ_TEST  (via drill 0.2)
  Top 0.102: v11.28,17.01 10.93,16.66 U1.M14
  Bottom 0.102: TP1.P$1 12.35,16.56 11.4,16.56 11.28,16.68 v11.28,17.01
34/DAT1  (via drill 0.2)
  Top 0.102: v3.5,4.85 3.8,4.55 4.09,4.55 4.69,5.14 7.75,5.14 9.1,6.5 9.35,6.5 U1.K1
  Bottom 0.102: v3.5,4.85 3.19,4.54 3.19,3.34 4,2.52 J1.66
35/DAT0  (via drill 0.2)
  Top 0.102: U1.J1 8.97,6.7 7.65,5.37 4.3,5.37 3.98,5.05 v3.98,4.92
  Bottom 0.102: v3.98,4.92 3.97,4.91 3.97,4.64 3.84,4.51 3.51,4.51 3.4,4.4 3.4,4.15 3.5,4.05 4.06,4.05 4.16,3.95 4.16,3.8 4.06,3.7 3.51,3.7 3.4,3.58 3.4,3.42 4.02,2.8 4.31,2.8 4.5,2.61 J1.64
36/CLK  (via drill 0.2)
  Top 0.102: v9.29,8.41 8.97,8.1 U1.J3
  Vert-GND 0.102: v5.37,2.86 5.22,2.71 4.82,2.71 4.5,3.03 4.5,3.75 4.71,3.96 4.71,6.96 4.75,7 v4.75,7.11
  Horz-3V3 0.102: v4.75,7.11 5.33,7.11 5.83,6.61 6.21,6.61 6.74,7.14 8.17,7.14 9.29,8.26 v9.29,8.41
  Bottom 0.102: v5.37,2.86 5.5,2.73 J1.60
37/CMD  (via drill 0.2)
  Top 0.102: U1.J4 8.65,8.4 v8.65,8.35
  Horz-3V3 0.102: v3.02,8.4 3.31,8.1 8.4,8.1 v8.65,8.35
  Bottom 0.102: v3.02,8.4 3.02,7.39 4.37,6.04 4.37,3.18 5,2.55 J1.62
38/DAT3  (via drill 0.2)
  Top 0.102: U1.J2 8.68,7.12 8.68,6.72 7.56,5.6 4.13,5.6 3.83,5.3 3.57,5.3 v3.32,5.55
  Bottom 0.102: J1.70 3,2.95 2.78,3.17 2.78,5.01 v3.32,5.55
39/DAT2  (via drill 0.2)
  Top 0.102: U1.H2 8.32,7.16 8.06,6.89 8.06,6.39 7.47,5.81 3.92,5.81 3.84,5.73 v3.74,5.73
  Bottom 0.102: v3.74,5.73 3.74,5.39 3.58,5.22 3.41,5.22 2.98,4.8 2.98,3.25 3.5,2.74 J1.68
A0/14  (via drill 0.2)
  Top 0.102: U1.L11 9.98,12.98 v9.98,12.91
  Vert-GND 0.102: v10.39,5.07 10.77,5.45 10.77,9.17 | v9.98,12.91 9.79,12.91 9.57,12.69 9.57,11.55 9.65,11.48 9.65,10.31 9.65,10.21 9.84,10.02 10.44,10.02 10.77,9.69 10.77,9.17 | 10.77,9.17
  Bottom 0.102: v10.39,5.07 10.39,5.1 10.61,5.33 11.24,5.33 12.33,4.24 12.33,2.87 12,2.55 J1.34
A1/15  (via drill 0.2)
  Top 0.102: U1.M12 10.93,13.97 v11.2,14.24
  Vert-GND 0.102: v11.2,14.24 11.18,14.22 11.18,12.13 10.82,11.77 10.82,11.43 10.93,11.32 10.93,10.57 10.89,10.54 10.89,10.16 11.01,10.04 11.01,5.13 10.9,5.01 v10.9,4.95
  Bottom 0.102: v10.9,4.95 10.66,4.71 10.66,3.55 11,3.21 J1.38
AUD_IN/8  (via drill 0.2)
  Top 0.102: v2.28,13.2 2.35,13.28 U1.A11 | v2.49,12.06 2.49,11.91 2.48,11.89 2.48,4.72 3.45,3.75 5,3.75 5.64,4.4 6.51,4.4 6.85,4.06 v6.85,4
  Vert-GND 0.102: v2.49,12.06 2.28,12.27 v2.28,13.2
  Bottom 0.102: v6.85,4 6.85,3.98 6.35,3.48 6.35,3.09 7,2.44 J1.54
AUD_OUT/7  (via drill 0.2)
  Top 0.102: U1.B11 4.42,13.32 v4.11,13.64
  Bottom 0.102: v4.11,13.64 v4.12,13.63 4.12,12.17 3.71,11.77 3.71,10.55 4.02,10.25 4.02,8.78 5.13,7.67 5.13,4.29 6.06,3.36 6.06,3.06 6.5,2.62 J1.56
BATT_VIN/22/A8  (via drill 0.2)
  Top 0.102: v8.05,17 8.05,16.56 8.64,15.96 8.64,14.89 U1.H13 | J1.49 8.25,2.1 8.33,2.18 8.33,2.65 8.31,2.67 v8.31,2.79
  Vert-GND 0.102: v8.05,17 8.45,16.6 8.45,15.6 6.69,13.84 6.69,7.26 8.12,5.83 8.12,2.97 v8.31,2.79
BCLK/21/A7  (via drill 0.2)
  Top 0.102: v8.64,17.43 8.7,17.37 8.7,17.35 9.29,16.76 9.29,15.11 8.97,14.79 U1.J13
  Vert-GND 0.102: v8.64,17.43 8.54,17.33 7.91,17.33 7.72,17.14 7.72,16.86 8.25,16.34 8.25,15.68 6.48,13.92 6.48,7.18 7.92,5.74 7.92,2.4 v8,2.31
  Bottom 0.102: J1.50 v8,2.31
BOOTMODE0
  Top 0.102: U1.F11 6.81,13.28 6.49,13.59 6.28,13.59 6.06,13.81 6.06,14.03 5.84,14.24 5.62,14.24 5.41,14.46 5.41,14.72 5.24,14.89 4.97,14.89 4.75,15.12 U3.4
CAN_RX/30
  Top 0.102: J1.41 10.25,2.7 10.24,2.7 10.24,3.47 10.44,3.66 10.44,4.14 9.52,5.05 8.02,5.05 7.88,4.92 4.79,4.92 4.19,4.32 3.5,4.32 2.94,4.87 2.94,5.74 3.26,6.06 4.74,6.06 5.34,6.66 5.34,8.07 5.61,8.34 5.99,8.34 U1.E4
CAN_TX/31
  Top 0.102: U1.C3 4.75,7.75 3.55,7.75 2.71,6.91 2.71,4.78 3.5,3.99 4.19,3.99 4.89,4.69 7.94,4.69 8.1,4.85 9.35,4.85 9.78,4.42 9.78,3.81 9.97,3.63 9.97,2.49 9.75,2.28 J1.43
CIPO/12  (via drill 0.2)
  Top 0.102: v4.98,3.22 4.94,3.18 4.94,2.32 5.25,2.01 J1.61 | U1.E7 6.38,10.62 v6.05,10.3
  Horz-3V3 0.102: v6.05,10.3 4.01,10.3 v3.46,9.75
  Bottom 0.102: v4.98,3.22 4.63,3.57 4.63,6.15 3.46,7.32 v3.46,9.75
COPI/11  (via drill 0.2)
  Top 0.102: U1.E8 6.05,11 v6.05,10.9 | v5.48,3.43 5.8,3.1 5.8,2.69 5.65,2.54 5.65,2.21 5.75,2.11 J1.59
  Horz-3V3 0.102: v3.44,10.36 3.65,10.57 5.72,10.57 v6.05,10.9
  Bottom 0.102: v5.48,3.43 4.88,4.03 4.88,6.27 3.79,7.35 3.79,10.01 v3.44,10.36
CS/10  (via drill 0.2)
  Top 0.102: U1.D7 5.4,10.35 5.4,9.9 5.61,9.69 6.44,9.69 6.69,9.44 6.69,9.28 6.71,9.27 6.71,8.61 6.9,8.41 7.07,8.41 7.29,8.19 7.29,8.07 7.56,7.81 7.88,7.81 v8,7.69 | J1.55 6.75,2.94 6.58,3.11 6.58,3.39 6.87,3.67 7.77,3.67 v8.45,4.35
  Bottom 0.102: v8.45,4.35 8.29,4.35 7.65,4.99 7.65,7.34 v8,7.69
D0/4  (via drill 0.2)
  Top 0.102: U1.H5 8.38,9.38 v8.67,9.09
  Horz-3V3 0.102: v18.86,7.47 18.56,7.77 15.79,7.77 15.43,8.13 13.6,8.13 13.23,7.76 11.81,7.76 10.01,9.56 9.15,9.56 v8.68,9.09 v8.67,9.09
  Bottom 0.102: v18.86,7.47 19.04,7.3 19.04,3.99 18,2.95 J1.10
D1/5  (via drill 0.2)
  Top 0.102: U1.H3 8.65,7.75 9.13,7.75 9.31,7.58 9.31,7.26 9.47,7.09 9.79,7.09 9.95,6.93 9.95,4.92 10.32,4.55 11.56,4.55 11.61,4.6 15.34,4.6 v15.59,4.35
  Bottom 0.102: J1.18 16,2.99 15.69,3.3 15.69,4.25 v15.59,4.35
DCDC_IN  (via drill 0.2)
  Top 0.254: U1.L2 U1.L1 10.42,6.63 v10.42,6.32
  Bottom 0.254: 10.42,6.22 10.64,6 C14.1 C10.1 C15.1 FB2.2 10.2,6 10.42,6.22 | v10.42,6.32 10.42,6.22
DCDC_LP
  Top 0.381: U1.M2 U1.M1
  Top 0.406: U1.M1 10.93,6.05 11.71,5.27 15.76,5.27 16.25,5.76 L2.1
DEBUG_EN  (via drill 0.2)
  Top 0.102: U3.15 1.75,18.75 v1.7,18.8 | U1.F3 6.76,8.07 6.49,7.81 6.17,7.81 v6.11,7.75
  Horz-3V3 0.102: v6.11,7.75 1.49,7.75 v1.14,7.4
  Bottom 0.102: v1.7,18.8 1.66,18.8 1.33,18.47 1.33,15.58 0.36,14.61 0.36,8.19 v1.14,7.4
DEBUG_SWO  (via drill 0.2)
  Top 0.102: U3.12 3.25,21.28 v3.2,21.33 | U1.D10 5.44,12.91 5.44,13.31 5.19,13.56 5.04,13.56 4.79,13.81 4.79,14.11 4.6,14.3 1.9,14.3 v0.7,15.5
  Bottom 0.102: v3.2,21.33 2.87,20.99 2.19,20.99 1.04,19.84 1.04,15.83 v0.7,15.5
GND  (via drill 0.2)
  Top 0.102: U1.E2 6.38,7.38 v6.05,7.06 | 9.02,11.05 9.27,11.05 v9.31,11.01 9.31,10.53 9.62,10.21 U1.K6 | v8,11 v8.6,11 9.02,11 9.02,11.05 | U1.J8 9.02,11.28 9.02,11.05 | U1.G14 7.67,15.92 v7.7,15.95 | U1.K13 9.68,14.57 v9.95,14.3 | U1.A14 3.4,14.85 v3.4,14.7 | U1.B5 4.42,9.42 v4.7,9.7 | U1.N5 11.41,9.38 v11.34,9.31 | U1.E13 v6.05,14.9 | v10.6,12.9 10.6,12.3 U1.L9 10.1,11.97 10.09,11.98 9.81,11.98 9.8,11.97 U1.K9 | U1.K2 9.84,7.64 10.03,7.64 10.08,7.69 v9.96,7.81 9.99,7.77 11.22,7.77 U1.N2 | U1.B10 4.68,12.88 v4.76,12.88 | U1.N8 11.84,11.32 12.11,11.59 12.68,11.59
  Bottom 0.102: C19.2 5.1,9.3 v4.7,9.7 | v9.96,7.81 10.05,7.71 11.79,7.71 C10.2 | v4.76,12.88 5.32,12.88 C18.2 | v20.66,6.37 20.91,6.37 C29.2 21.65,7.11 21.65,7.56
  Bottom 0.305: C16.2 7.27,9.87 7.53,9.87 7.96,10.3 C3.2
  other vias: 3.31,6.52 3.6,16.6 0.4,19 0.6,21.2 12.66,6.57 8.96,4.47 1.46,2.52 20.48,2.95 20.91,14.72 19.71,14.02 16.31,15.45 15.16,14.02 17.68,10.75 13.63,12.5 18.71,4.17 13.11,8.47 13.21,16.22 13.76,15.32 12.66,3.72 11.21,4.12 15.73,12.63 18.73,2.9 15.21,10.37
  pour Bottom (isolate 0.127): 0,0.6 0,22 22,22 22,0.6
  pour Top (isolate 0.127): 0,0.6 0,22 22,22 22,0.6
  pour Vert-GND (isolate 0.127): 0,0.6 0,22 22,22 22,0.6
  pour Horz-3V3 (isolate 0.127): 14,22.01 22,22.01 22,6.41 3,6.41 3,16.01 12,16.01 14,18.01
  pour Horz-3V3 (isolate 0.102): 3,4.56 19,4.56 19,0.61 3,0.61
GPIO/6  (via drill 0.2)
  Top 0.102: U1.D9 6.08,12.32 v6.08,12.37 | v1.28,9.7 1.28,9.45 0.81,8.99 0.81,8.3 1.49,7.62 1.49,5.6 1.16,5.27 1.16,4.5 2.75,2.91 J1.71
  Bottom 0.102: v1.28,9.7 0.98,10 0.98,13.82 1.24,14.07 4.27,14.07 4.49,13.85 4.49,13.36 4.4,13.27 4.4,12.78 4.88,12.3 6.01,12.3 v6.08,12.36 v6.08,12.37
GPIO/9
  Top 0.102: J1.69 3.25,2.75 1.36,4.63 1.36,5.19 1.74,5.56 1.74,7.66 1.02,8.38 1.02,8.9 1.61,9.49 1.61,12.06 2.17,12.62 U1.A10
GPIO/26/A12  (via drill 0.2)
  Top 0.102: v1.71,4.91 1.71,4.63 3.75,2.58 J1.67
  Top 0.114: U1.G12 7.48,13.73 v7.48,13.66
  Bottom 0.102: v1.71,4.91 1.71,7.93 0.76,8.88 0.76,14.36 2.16,15.76 4.17,15.76 6.23,13.7 7.44,13.7 v7.48,13.66
GPIO/27/A13  (via drill 0.2)
  Top 0.102: U1.J14 8.97,16.63 8.31,17.3 8.31,18.32 8.65,18.66 10.77,18.66 11.06,18.37 11.06,17.78 11.38,17.46 14.85,17.46 16.04,18.65 v19.01,18.65
  Bottom 0.102: J1.8 18.5,2.53 18.35,2.68 18.35,3.01 19.24,3.91 19.24,7.56 18.73,8.07 18.73,10.02 18.65,10.1 18.65,18.29 v19.01,18.65
GPIO/28/3.3V_EN  (via drill 0.2)
  Top 0.102: U1.D5 6.05,9.05 v6.05,8.96
  Horz-3V3 0.102: v6.05,8.96 6.54,8.96 7.96,10.38 9.35,10.38 9.72,10.02 10.11,10.02 10.12,10.02 11.32,10.02 11.96,9.38 18.88,9.38 v19.38,8.89
  Bottom 0.102: J1.4 19.5,3.59 19.65,3.74 19.65,4.51 19.65,7.75 19.38,8.02 v19.38,8.88 v19.38,8.89
GPIO/32
  Top 0.102: U1.C10 4.81,12.36 3.52,12.36 3.49,12.38 2.31,12.38 1.81,11.89 1.81,9.41 1.22,8.82 1.22,8.46 2.07,7.61 2.07,4.55 4.25,2.37 J1.65
GPIO/33  (via drill 0.2)
  Top 0.102: U1.H4 8.03,8.43 v8.01,8.43 | v1.55,8.6 2.27,7.88 2.27,4.63 3.36,3.55 4.01,3.55 4.74,2.82 4.74,2.24 4.75,2.23 J1.63
  Horz-3V3 0.102: v1.55,8.6 1.76,8.81 3.23,8.81 3.61,8.43 v8.01,8.43
GPIO/40  (via drill 0.2)
  Top 0.102: U1.C8 4.8,11.05 v4.76,11.05
  Vert-GND 0.102: v4.76,11.05 4.76,11.04 4.07,10.35 4.07,9.42 3.55,8.89 3.55,8.18 2.96,7.59 2.96,3.78 4.76,1.99 10.27,1.99 10.57,2.28 v10.57,2.84
  Bottom 0.102: v10.57,2.84 10.5,2.77 J1.40
GPIO/41  (via drill 0.2)
  Top 0.102: U1.B8 v4.11,11.01 v4.11,11
  Vert-GND 0.102: v4.11,11 4.11,10.7 3.87,10.46 3.87,9.52 3.34,8.99 3.34,8.26 2.76,7.68 2.76,3.7 4.67,1.78 10.36,1.78 11,2.43 11,2.88 10.11,3.77 v10.11,4
  Bottom 0.102: v10.11,4 10,3.89 J1.42
GPIO/42  (via drill 0.2)
  Top 0.102: U1.A8 3.77,11.27 v3.36,10.85
  Vert-GND 0.102: v9.61,3 9.78,3.17 9.78,4.14 9.97,4.33 10.25,4.33 10.44,4.14 10.44,3.72 11.2,2.96 11.2,2.34 10.44,1.58 4.59,1.58 2.55,3.61 2.55,10.24 3.16,10.85 v3.36,10.85
  Bottom 0.102: v9.61,3 9.5,2.89 J1.44
GPIO/43  (via drill 0.2)
  Top 0.102: U1.A9 3.44,11.97 v3.36,12.05
  Vert-GND 0.102: v3.36,12.05 3.36,11.52 2.35,10.5 2.35,3.53 4.5,1.38 10.53,1.38 11.41,2.26 11.41,3.04 10.64,3.81 10.64,4.22 10.33,4.53 9.89,4.53 9.58,4.22 9.58,3.58 v9.45,3.45
  Bottom 0.102: v9.45,3.45 9,3 J1.46
GPIO/44  (via drill 0.2)
  Top 0.102: U1.B9 4.1,11.65 v4.06,11.65
  Vert-GND 0.102: v4.06,11.65 4.06,11.96 3.65,12.38 3.22,12.38 3.03,12.19 3.03,11.57 2.15,10.69 2.15,3.45 4.42,1.17 10.61,1.17 11.61,2.17 11.61,3.13 10.85,3.89 10.85,4.3 10.41,4.73 9.8,4.73 9.38,4.3 9.38,4.15 v9.25,4.02
  Bottom 0.102: v9.25,4.02 8.94,3.71 8.94,3.33 8.64,3.03 8.64,2.65 8.5,2.51 J1.48
GPIO/45  (via drill 0.2)
  Top 0.102: U1.C9 v4.76,11.66 v4.76,11.65 | v1.14,6.9 1.21,6.83 1.21,5.61 0.96,5.35 0.96,4.42 2.25,3.12 2.25,2.63 2.25,2.62 J1.73
  Vert-GND 0.102: v4.76,11.65 4.76,11.87 4.04,12.58 3.14,12.58 2.83,12.27 2.83,11.71 1.91,10.79 1.91,7.67 v1.14,6.9
I2C_!INT!/29  (via drill 0.2)
  Top 0.102: U1.C5 4.76,9.06 v4.76,9
  Horz-3V3 0.102: v16.68,7.42 18.2,7.42 18.48,7.14 19.05,7.14 19.34,7.44 19.34,7.81 19.14,8.01 15.89,8.01 15.57,8.33 13.52,8.33 13.15,7.96 11.9,7.96 10.05,9.81 9.63,9.81 9.34,10.11 7.98,10.11 6.5,8.63 5.13,8.63 v4.76,9
  Bottom 0.102: v16.68,7.42 v16.67,7.41 16.67,6.17 17.06,5.77 17.06,3.01 16.5,2.45 J1.16
JTAG_MOD  (via drill 0.2)
  Top 0.102: U3.13 1.94,19.77 1.85,19.85 1.85,20.11 v2.09,20.35 | U1.F13 6.64,14.96 6.64,15.47 6.4,15.71 v6.4,16.36
  Bottom 0.102: v2.09,20.35 2.48,20.74 4.07,20.74 6.17,18.63 6.17,16.59 v6.4,16.36
JTAG_TCK
  Top 0.102: U3.8 6.55,19.75 7.41,18.89 7.41,17.5 7.62,17.3 7.62,16.55 8.04,16.12 8.04,14.54 7.79,14.29 7.39,14.29 U1.F12
JTAG_TDI  (via drill 0.2)
  Top 0.102: U3.7 6.3,19.25 v6.37,19.33 | U1.F14 7.08,15.28 7.08,16.58 v6.55,17.1
  Bottom 0.102: v6.37,19.33 6.55,19.15 v6.55,17.1
JTAG_TDO
  Top 0.102: U3.6 6.3,18.75 6.6,18.45 6.6,17.92 7.34,17.17 7.34,14.91 U1.G13
JTAG_TMS
  Top 0.102: U1.E14 5.92,15.68 5.92,17.06 6.25,17.39 6.25,18.16 6.16,18.25 U3.5
JTAG_TRST  (via drill 0.2)
  Top 0.102: U3.3 v4.25,16.5 4.25,16.05 4.1,15.9 | R5.2 1,16.9 2,15.9 4.1,15.9 | U1.K3 9.68,8.07 v9.94,8.33 | 4.1,15.9 4.1,15.15 4.39,14.86 4.54,14.86 4.79,14.61 4.79,14.46 5.04,14.21 5.19,14.21 5.36,14.04 5.36,13.89 5.61,13.64 5.76,13.64 6.09,13.31 6.09,13.16 6.26,12.99 7.11,12.99 7.47,12.63 7.51,12.63 7.51,12.62 U1.G10
  Vert-GND 0.102: v8.85,18.15 9,18 9,17.2 8.76,16.96 8.76,15.56 6.89,13.69 6.89,7.42 8.34,5.98 8.34,5.07 8.43,4.98 8.78,4.98 9,5.2 9,7.48 9.85,8.33 v9.94,8.33
  Horz-3V3 0.102: v4.25,16.5 5.72,17.97 7.13,17.97 7.66,18.5 8.5,18.5 v8.85,18.15
LRCLK/20/A6  (via drill 0.2)
  Top 0.102: U1.L13 9.97,14.88 9.97,17.5 v9.71,17.75
  Vert-GND 0.102: v7.57,2.83 v7.57,2.84 7.69,2.95 7.69,4.16 5.65,6.21 5.65,8.11 5.7,8.16 5.7,12.6 5.71,12.61 5.71,15.35 6.08,15.71 6.94,15.71 7.17,15.94 7.17,17.52 v7.79,18.14
  Horz-3V3 0.102: v9.71,17.75 9.69,17.77 8.16,17.77 v7.79,18.14
  Bottom 0.102: v7.57,2.83 7.5,2.75 J1.52
MCLK/23/A9  (via drill 0.2)
  Top 0.102: U1.M13 10.93,14.83 11.21,15.11 11.21,15.75 11.82,16.37 v11.82,17
  Vert-GND 0.102: v5.99,2.35 5.86,2.22 4.81,2.22 4.14,2.89 4.14,3.9 4.32,4.07 4.32,7.3 4.95,7.94 4.95,8.33 5.09,8.47 5.09,12.85 5.1,12.86 5.1,16.35 v5.45,16.7
  Horz-3V3 0.102: v5.45,16.7 6.57,16.7 6.61,16.66 11.48,16.66 v11.82,17
  Bottom 0.102: v5.99,2.35 v6,2.35 J1.58
N$2
  Top 0.102: R1.1 20.45,11.05 20.45,20.57 D1.A
N$7
  Bottom 0.102: Q2.3 2.54,10.88 3.04,11.38 R2.2 3.03,12.51 Q1.1
N$10  (via drill 0.2)
  Top 0.203: FB1.1 18.33,10.21 | 18.33,10.21 v19.3,10.21 | C11.1 18.33,11.38 18.33,10.21
  Bottom 0.203: v19.3,10.21 19.44,10.35 19.44,10.99 18.95,11.47 18.95,12.59 19.34,12.97 MEAS.2
N$12  (via drill 0.2)
  Top 0.102: U3.11 3.75,21.26 v3.7,21.31 | v11.2,20.21 11.2,20.31 11.5,20.61 R7.1
  Horz-3V3 0.102: v3.7,21.31 3.77,21.31 4.41,20.67 10.74,20.67 v11.2,20.21
N$13
  Top 0.102: R7.2 D5.C
NVCC_PLL  (via drill 0.2)
  Top 0.102: U1.P10 12.84,12.62 v12.92,12.71
  Bottom 0.102: v12.92,12.71 C24.1 13.05,12.85 14.25,12.85 C26.1 14.3,14.25 TP6.P$1
ON/!OFF!  (via drill 0.2)
  Top 0.102: U1.M6 11.22,10.32 v11.22,10.35
  Horz-3V3 0.102: v19.01,10.78 17.85,9.61 12.06,9.61 11.32,10.35 v11.22,10.35
  Bottom 0.102: J1.6 19,2.58 19.1,2.68 19.1,3.48 19.45,3.82 19.45,7.64 18.93,8.16 18.93,10.7 v19.01,10.78
PMIC  (via drill 0.2)
  Top 0.102: U1.K7 9.62,10.65 9.67,10.65 v9.98,10.35
  Horz-3V3 0.102: v3.07,10.02 3.07,9.64 3.33,9.37 6.56,9.37 7.02,9.84 7.02,10.44 7.21,10.63 9.39,10.63 9.68,10.35 v9.98,10.35
  Bottom 0.102: Q2.1 3.07,9.09 3.07,9.61 | v3.07,10.02 3.07,9.61 | R6.2 10.02,10.3 v9.98,10.35 | 3.07,9.61 2.07,9.61 1.55,10.13 TP2.P$1
PORB_RESET  (via drill 0.2)
  Top 0.102: U3.9 6.21,20.5 7.21,19.5 9.8,19.5 | U1.M7 11.25,11 v11.27,11
  Top 0.114: 9.8,19.5 10.28,19.5 11.5,18.28 v11.5,17.8
  Vert-GND 0.102: v11.27,11 11.37,11 11.56,11.19 11.56,16.07 12.15,16.66 12.15,17.15 v11.5,17.8
PROGRAM  (via drill 0.2)
  Top 0.102: U3.10 4.25,21.3 v4.22,21.33 | v17.94,3.94 17.75,3.75 J1.11
  Horz-3V3 0.102: v4.22,21.33 11.25,21.33 v12.12,20.46
  Bottom 0.102: v17.94,3.94 18.52,4.52 18.52,9.93 18.45,10.01 18.45,17.65 17.95,18.15 13.48,18.15 12.2,19.43 12.2,20.39 v12.12,20.46
PWM0/3  (via drill 0.2)
  Top 0.102: U1.G5 7.37,9.07 v7.37,9.04
  Bottom 0.102: J1.32 12.5,2.53 12.77,2.79 12.77,3.37 12.98,3.59 12.98,3.87 11.32,5.53 9.35,5.53 9.2,5.68 9.2,7.52 9.06,7.65 9.05,7.65 8.9,7.81 8.42,7.81 8.12,8.1 7.87,8.1 7.37,8.6 v7.37,9.04
PWM1/2  (via drill 0.2)
  Top 0.102: U1.F2 6.7,7.1 6.7,6.5 v6.65,6.45 | v8.46,3.7 8.75,3.41 J1.47
  Bottom 0.102: v8.46,3.7 6.65,5.51 v6.65,6.45
QSPI0  (via drill 0.2)
  Top 0.102: U1.P3 12.24,8.07 12.28,8.04 13.4,8.04 v13.69,7.75
  Horz-3V3 0.102: v13.69,7.75 13.72,7.72 15.5,7.72 16.32,6.89 19.38,6.89 20.1,7.61 20.1,9.71 20.4,10.01 20.6,10.01 20.85,9.76 v20.85,8.85 v20.86,8.84
  Bottom 0.102: U4.5 20.86,8.96 v20.86,8.84
QSPI1  (via drill 0.2)
  Top 0.102: U1.N4 11.79,8.72 12.12,8.39 12.39,8.39 12.41,8.37 v12.56,8.37
  Bottom 0.102: v12.56,8.37 11.71,8.37 11.55,8.21 11.55,8.06 11.65,7.96 12.5,7.96 13.15,7.31 13.15,5.41 13.05,5.31 12.6,5.31 12.5,5.21 12.5,5.01 12.7,4.81 14.55,4.81 14.65,4.91 14.65,5.21 14.55,5.31 13.5,5.31 13.4,5.41 13.4,7.21 13.6,7.41 13.75,7.41 13.85,7.31 13.85,7.16 14,7.01 14.72,7.01 U4.2
QSPI2  (via drill 0.2)
  Top 0.102: U1.P4 12.44,8.72 12.52,8.8 13.49,8.8 14.04,8.26 14.04,7.34 13.48,6.79 13.48,6.39 13.29,6.19 11.98,6.19 11.85,6.06 11.85,5.81 11.99,5.67 14.31,5.67 14.6,5.96 14.9,5.96 15.01,6.07 15.01,6.4 14.9,6.51 14.79,6.51 14.66,6.64 14.66,6.94 14.79,7.07 14.9,7.07 15.03,7.2 15.03,7.45 14.9,7.58 14.79,7.58 14.66,7.71 14.66,8.01 14.79,8.14 14.9,8.14 15.03,8.27 15.03,8.6 | v14.5,8.96 14.7,8.76 14.86,8.76 15.03,8.6 | 15.03,8.6
  Bottom 0.102: U4.3 14.5,8.5 v14.5,8.96
QSPI3  (via drill 0.2)
  Top 0.102: v14.06,6.61 14.06,6.78 14.44,7.17 14.44,8.48 13.69,9.23 12.36,9.23 12.22,9.36 U1.P5
  Horz-3V3 0.102: v14.06,6.61 15.27,6.61 15.92,5.96 16.45,5.96 16.65,6.16 17.05,6.16 17.25,5.96 19.45,5.96 20.9,7.41 v20.9,7.51 | v20.9,7.51
  Bottom 0.102: U4.7 20.29,7.39 20.4,7.51 v20.9,7.51
QSPI-CLK  (via drill 0.2)
  Top 0.102: U1.L4 v9.95,9.05
  Horz-3V3 0.102: v9.95,9.05 11.69,7.31 15.51,7.31 16.21,6.61 19.66,6.61 20.41,7.36 20.41,7.81 v20.86,8.26
  Bottom 0.102: U4.6 v20.85,8.27 v20.86,8.26
QSPI-CS  (via drill 0.2)
  Top 0.102: v13.74,6.01 13.69,6.06 13.69,6.71 14.24,7.25 14.24,8.4 13.62,9.01 11.48,9.01 11.19,8.72 11.19,8.61 11.04,8.46 10.66,8.46 U1.L3
  Bottom 0.102: U4.1 14.03,5.72 v13.74,6.01
RX0/0  (via drill 0.2)
  Top 0.102: U1.G11 8,13.6 v8.59,13.6 | J1.19 15.75,3.07 v16.24,3.56
  Horz-3V3 0.102: v16.61,16.48 v16.61,16.49 16.49,16.61 12.95,16.61 12.12,15.77 9.64,15.77 8.32,14.45 8.32,13.83 8.55,13.6 v8.59,13.6
  Bottom 0.102: v16.24,3.56 16.24,5.06 16.14,5.15 16.14,9.37 17.14,10.37 17.14,10.97 17.61,11.44 17.61,16.07 17.2,16.48 v16.61,16.48
RX1/16/A2  (via drill 0.2)
  Top 0.102: U1.K10 9.9,12.35 v9.9,12.33
  Horz-3V3 0.102: v9.9,12.33 9.9,12.43
  Horz-3V3 0.114: 9.9,12.43 10.04,12.56 12.14,12.56 12.59,12.11 16.63,12.11 v16.79,11.96
  Bottom 0.102: J1.20 15.5,2.88 15.45,2.93 15.45,3.99 15.26,4.19 15.26,4.6 15.74,5.08 15.74,9.53 16.74,10.54 16.74,11.14 16.79,11.19 v16.79,11.96
SCK/13  (via drill 0.2)
  Top 0.102: v20.3,4.5 20.1,4.7 20.1,6.54 20.35,6.79 20.35,9.15 20.7,9.5 R1.2 | U1.D8 v6.05,11.65 | v6.11,3.94 6.16,3.89 6.16,3.06 6.39,2.82 6.39,2.18 6.25,2.04 J1.57
  Horz-3V3 0.102: v6.11,3.94 7.15,4.98 9.91,4.98 10.34,4.54 11.07,4.54 11.3,4.78 20.02,4.78 v20.3,4.5
  Bottom 0.102: v6.11,3.94 5.61,4.44 5.61,7.58 4.29,8.9 4.29,10.02 5.55,11.27 5.79,11.27 5.93,11.4 5.93,11.53 v6.05,11.65
SCL1/24/A10  (via drill 0.2)
  Top 0.102: U1.K14 9.62,17.18 v9.6,17.2 | J1.53 7.25,2.18 6.96,2.47 6.96,3.2 v6.91,3.25
  Vert-GND 0.102: v5.83,17.58 5.83,16.18 5.31,15.65 5.31,12.78 5.29,12.77 5.29,8.38 5.19,8.28 5.19,5.43 6.51,4.11 6.51,3.64 v6.91,3.25
  Horz-3V3 0.102: v9.6,17.2 8.99,17.2 8.83,17.04 8.49,17.04 8.17,17.36 7.65,17.36 7.43,17.58 v5.83,17.58
SCL/19/A5  (via drill 0.2)
  Top 0.102: U1.J11 8.65,12.95 v8.65,12.87
  Horz-3V3 0.102: v8.65,12.87 8.56,12.87 7.91,13.53 7.91,14.61 9.48,16.18 11.95,16.18 12.79,17.01 16.25,17.01 16.58,17.34 17.59,17.34 17.77,17.17 17.77,16.84 17.78,16.83 v17.78,16.65
  Bottom 0.102: J1.14 17,2.61 17.26,2.88 17.26,4.16 18.11,5.01 18.11,5.55 18.12,5.56 18.12,9.77 18.04,9.84 18.04,16.39 v17.78,16.65
SDA1/25/A11  (via drill 0.2)
  Top 0.102: U1.L14 10.28,17.43 10.31,17.46 10.31,18.11 v10.38,18.18 | v7.36,3.34 7.36,3.3 7.23,3.17 7.23,2.62 7.75,2.1 J1.51
  Vert-GND 0.102: v7.36,3.34 7.36,4.12 5.42,6.06 5.42,8.22 5.5,8.3 5.5,12.68 5.51,12.7 5.51,15.53 5.92,15.94 6.83,15.94 6.9,16.01 6.9,18.22 v6.99,18.31
  Horz-3V3 0.102: v10.38,18.18 9.96,18.18 9.38,18.76 7.44,18.76 v6.99,18.31
SDA/18/A4  (via drill 0.2)
  Top 0.102: U1.K11 9.7,13.28 v10.02,13.59
  Horz-3V3 0.102: v10.02,13.59 10.02,13.49 9.62,13.1 9.62,12.81 8.79,11.97 8.51,11.97 7.09,13.4 7.09,14.08 9.39,16.38 11.87,16.38 12.7,17.22 16.16,17.22 16.49,17.55 17.8,17.55 18.09,17.25 v18.09,16.98
  Bottom 0.102: J1.12 17.5,3.97 18.32,4.79 18.32,9.85 18.24,9.93 18.24,16.83 v18.09,16.98
SWD_CLK  (via drill 0.2)
  Top 0.102: U3.14 1.82,19.25 1.65,19.43 1.65,20.58 1.78,20.71 2.59,20.71 2.7,20.6 v2.7,20.35
  Bottom 0.102: TP9.P$1 3.56,19.5 v2.7,20.36 v2.7,20.35
SWD_DIO  (via drill 0.2)
  Top 0.102: U3.16 1.95,18.25 v1.7,18
  Bottom 0.102: v1.7,18 2,17.7 TP8.P$1
TX0/1  (via drill 0.2)
  Top 0.102: U1.M11 10.6,13.6 10.6,17.12 v10.7,17.22 | J1.17 16.25,2.75 v16.58,3.08
  Horz-3V3 0.102: v16.08,17.62 15.93,17.47 11.2,17.47 10.95,17.22 v10.7,17.22
  Bottom 0.102: v16.58,3.08 16.43,3.23 16.1,3.23 15.91,3.42 15.91,3.77 15.94,3.8 15.94,9.45 16.94,10.45 16.94,11.05 17.41,11.52 17.41,15.98 17.24,16.15 16.47,16.15 16.08,16.55 v16.08,17.62
TX1/17/A3  (via drill 0.2)
  Top 0.102: U1.J12 8.65,14.25 v8.65,14.3 | v15.09,3.88 15.13,3.92 16.24,3.92 v16.68,4.37
  Horz-3V3 0.102: v17.42,16.95 16.47,16.95 16.33,16.81 12.87,16.81 12.03,15.97 9.56,15.97 8.12,14.53 8.12,13.61 8.45,13.27 8.73,13.27 8.92,13.46 8.92,14.03 v8.65,14.3
  Bottom 0.102: v16.68,4.37 16.58,4.47 16.58,5.74 16.35,5.98 16.35,9.28 17.35,10.28 17.35,10.89 17.81,11.35 17.81,16.15 17.42,16.55 v17.42,16.95 | v15.09,3.88 15,3.79 J1.22
USB2_D+  (via drill 0.2)
  Top 0.114: v13.63,10.75 13.56,10.67 U1.P7 | J1.35 11.75,3.56 v11.95,3.76
  Vert-GND 0.114: v11.95,3.76 11.95,3.93 12.12,4.1 12.12,4.4 12,4.52 12,8.32 13.41,9.73 13.76,9.73 13.97,9.94 13.97,10.49 13.71,10.75 v13.63,10.75
USB2_D-  (via drill 0.2)
  Top 0.114: v13.61,10.24 13.41,10.24 13.28,10.37 12.55,10.37 12.1,10.37 11.79,10.67 U1.N7 | v11.76,4.25 11.76,4.15 11.5,3.89 11.5,2.32 11.25,2.07 J1.37
  Vert-GND 0.114: v11.76,4.25 11.76,8.54 13.46,10.24 v13.61,10.24
USB_D+  (via drill 0.2)
  Top 0.114: U1.L8 10.27,11.32 10,11.06 v10,11.01 | v19.97,11.3 19.97,10.39 20.03,10.33 20.03,6.9 19.69,6.57 19.69,2.62 19.75,2.56 J1.3
  Horz-3V3 0.114: v10,11.01 10.58,11.59 10.58,11.84 10.98,12.24 11.57,12.24 12.11,11.71 14.07,11.71 14.77,11.01 16.93,11.01 17.98,12.06 19.46,12.06 19.97,11.56 v19.97,11.3
USB_D-  (via drill 0.2)
  Top 0.114: U1.M8 10.87,11.32 v10.57,11.03 | J1.5 19.25,2.41 19.45,2.61 19.45,6.67 19.79,7 19.79,10.23 19.67,10.35 19.67,11.04 19.42,11.29 v19.42,11.59
  Horz-3V3 0.114: v10.57,11.03 10.82,11.27 10.82,11.74 11.08,12 11.47,12 12.01,11.47 13.97,11.47 14.67,10.77 17.03,10.77 17.95,11.69 18.07,11.69 18.15,11.61 18.15,11.26 18.25,11.16 18.45,11.16 18.55,11.26 18.55,11.66 18.7,11.81 19.3,11.81 19.42,11.69 v19.42,11.59
V_BATT
  Bottom 0.102: D3.A 6.7,15.65 6.34,16.01 2.05,16.01 0.56,14.52 0.56,8.79 1.5,7.85 1.5,6.51 0.53,5.54 0.53,4.8 0.81,4.53 1.15,4.53 2.5,3.18 J1.72
V_USB  (via drill 0.2)
  Top 0.203: J1.9 18.25,3.71 18.32,3.78 18.32,8.42 v19.43,9.54
  Bottom 0.203: MEAS.1 20.6,10.88 19.43,9.71 v19.43,9.54
VCC  (via drill 0.2)
  Top 0.203: FB1.2 15.53,10.16 15.36,9.99 13.94,9.99 13.78,9.83 13.41,9.83 13.24,10.01 v12.7,10.01 12.69,10.03 U1.P6 U1.N6
  Bottom 0.152: TP3.P$1 11.44,8.7 12.16,8.7 12.45,8.99 12.45,9.76 v12.7,10.01
  Bottom 0.203: C12.1 12.95,10.3 12.95,10.26
  Bottom 0.254: C13.1 12.95,10.3 | v12.7,10.01 12.95,10.26
VDD_HIGH_CAP  (via drill 0.2)
  Top 0.102: v12.68,11.11 12.44,11.11 U1.P8
  Bottom 0.102: v12.68,11.11 12.75,11.17 14.62,11.17 14.8,11.36 14.8,11.81 | C27.1 C25.1 14.8,11.81 | 14.8,11.81 14.8,14.15 15.26,14.61 16.09,14.61 TP7.P$1
VDD_SNVS_CAP  (via drill 0.2)
  Top 0.102: U1.M10 11.13,12.62 11.28,12.77 11.28,13.43 11.47,13.62 11.68,13.62 11.88,13.82 11.88,14.13 v11.98,14.24
  Bottom 0.102: C23.1 11.44,14.66 10.5,14.66 9.95,15.21 9.95,16.11 9.36,16.7 TP5.P$1
  Bottom 0.114: C23.1 11.92,14.3 v11.98,14.24
VDD_SNVS_IN  (via drill 0.2)
  Top 0.102: U1.M9 10.93,11.94 v11.23,11.63 | v11.23,11.63
  Bottom 0.102: 7.05,14.46 7.41,14.81 8.36,14.81 9.05,15.5 D4.C 10.3,14.5 10.3,14.4 D2.C 10.8,14.1 11.32,13.58 11.32,12 | 7.05,14.46 D3.C | C22.1 11.8,11.97 11.35,11.97 11.32,12 | v11.23,11.63 11.32,11.72 11.32,12 | TP4.P$1 6.06,15.45 7.05,14.46
VDD_SOC_IN  (via drill 0.2)
  Top 0.203: 14.16,9.57 14.15,9.57 14.11,9.53 12.52,9.53 12.35,9.71 9.3,9.71 | U1.J5 9.3,9.71 | 9.3,9.71 9.29,9.71 9.29,10.16 9.11,10.35 8.48,10.35 8.32,10.19 U1.H6 U1.G6 7.35,10.03 | 7.35,10.03 U1.F6 7.03,10.31 | 7.03,10.31 U1.F7 U1.F8 7.03,11.71 | U1.J9 8.91,11.92 8.39,11.92 8.34,11.97 U1.H9 U1.G9 7.67,11.96 7.62,11.9 7.21,11.9 7.14,11.97 U1.F9 7.03,11.71 | v7.35,11.75 7.07,11.75 7.03,11.71 | 7.03,10.31 7.04,10.3 v7.35,10.3 7.35,10.03
  Top 0.406: L2.2 16.25,9.01 15.69,9.57 14.16,9.57
  Bottom 0.102: 6.5,12 5.6,12
  Bottom 0.152: C18.1 5.6,12 | 6.5,12 C17.1 | C17.1 7.3,11.2 | v7.35,11.75 6.75,11.75 C17.1 | 7.3,10.9 C16.1 | C16.1 v7.35,10.3 | C16.1 6.34,9.94 5.76,9.94 C19.1
  Bottom 0.203: 7.3,11.2 TP10.P$1 7.3,10.9
VDD_USB_CAP  (via drill 0.2)
  Top 0.102: U1.K8 v9.94,11.64 v9.95,11.64
  Vert-GND 0.102: v9.32,13.58 9.32,17.02 9.27,17.06 9.27,18.1 v9.35,18.18
  Bottom 0.102: v9.95,11.64 v9.95,11.65 10.1,11.8 C20.1 10.63,11.8 11.08,12.25 11.08,13.29 10.87,13.5 10.59,13.5 10.16,13.92 9.77,13.92 9.59,14.1 D4.A | C21.1 8.15,14.3 8.48,14.63 8.78,14.63 9.3,14.11 D4.A | D4.A 9.3,13.59 v9.32,13.58 | v9.35,18.18 9.35,19.58 8.8,20.13 TP11.P$1

### Text on the board
Bottom: v15
tDocu: 0.8mm PCB / 45 degree chamfered edge / Four layer design / ENIG Finish | N. Seidle